# Altium project TemperatureController.PrjPcb (part 3 of 4)

## Sheet vioutchn1.SchDoc: VIOUTCHN1
size A4 portrait; Organization: 合肥弗雷电子; Address1: 玉兰大道14号D栋3楼; Address2: 肥西县桃花镇; Address3: 合肥市; Address4: 安徽省
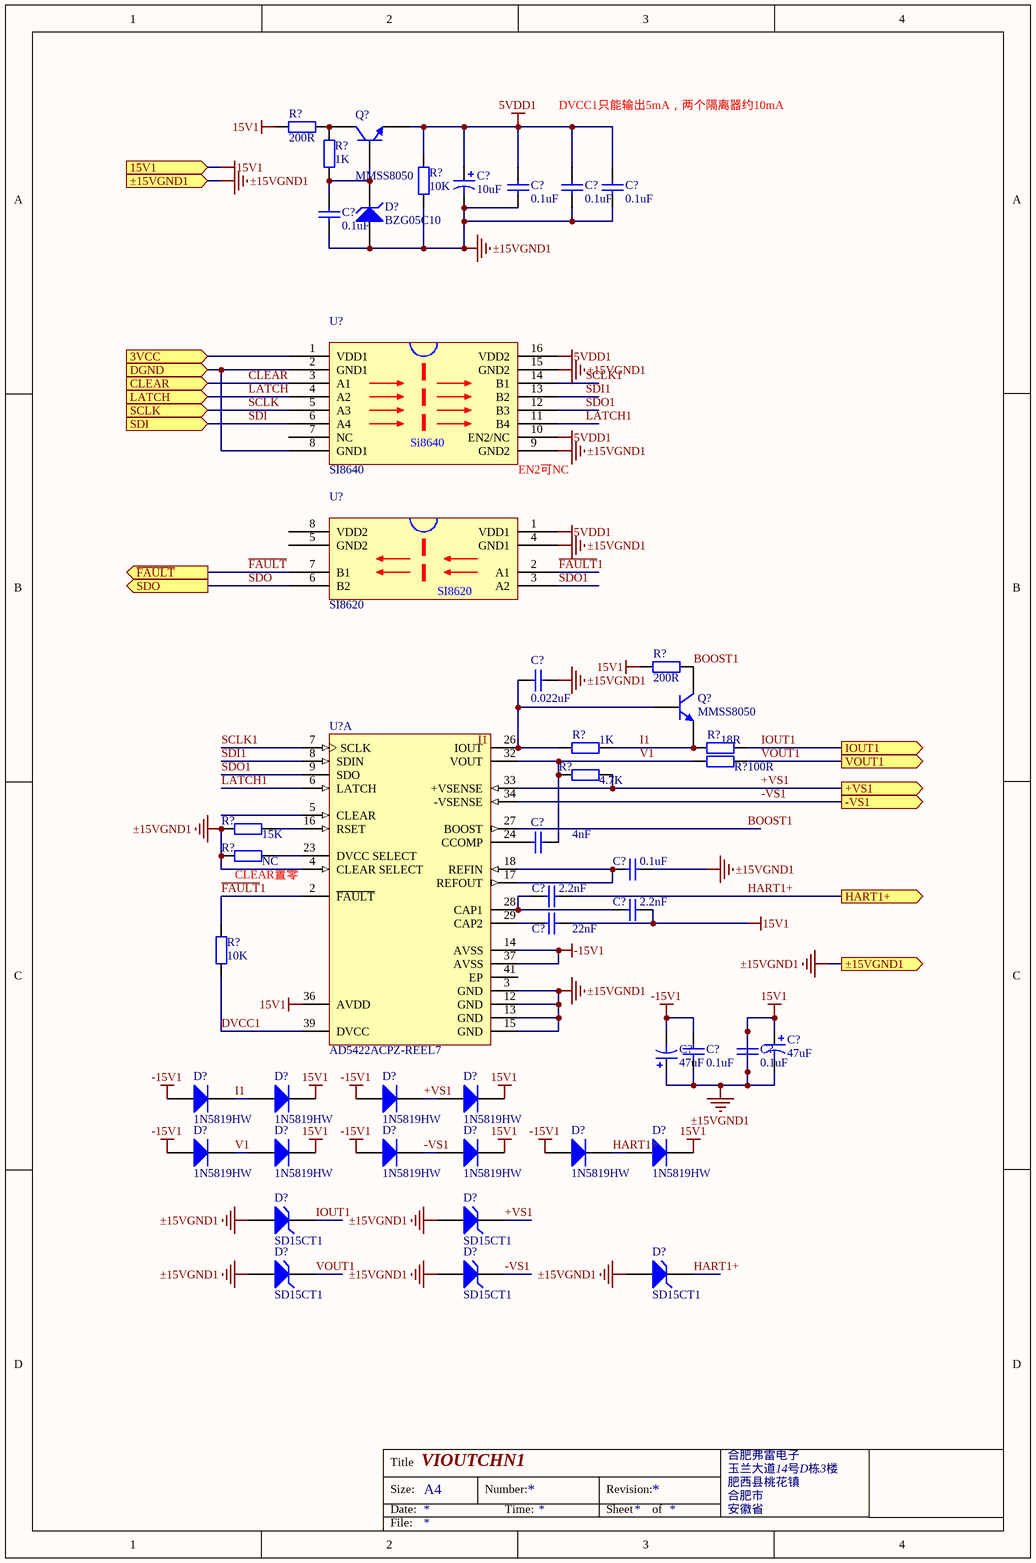
[diagram p7: vioutchn1.SchDoc]

### Parts
(Parts that share a designator on the sheet are numbered #1, #2 ... from top to bottom, then left to right.)
C?#41  value 10uF  [CB]  (hidden comment: T494B106M006AHAUTO)
C?#42  value 0.1uF  [0805c]  (hidden comment: CC0805MRX7R9BB104)
C?#43  value 0.1uF  [0805c]  (hidden comment: CC0805MRX7R9BB104)
C?#44  value 0.1uF  [0805c]  (hidden comment: CC0805MRX7R9BB104)
C?#45  value 0.1uF  [0805c]  (hidden comment: CC0805MRX7R9BB104)
C?#46  value 0.022uF  [0805c]  (hidden comment: CC0805MRX7R9BB103)
C?#47  value 4nF  [0805c]
C?#48  value 0.1uF  [0805c]  (hidden comment: CC0805MRX7R9BB104)
C?#49  value 2.2nF  [0805c]
C?#50  value 2.2nF  [0805c]
C?#51  value 22nF  [0805c]
C?#52  value 0.1uF  [0805c]  (hidden comment: CC0805MRX7R9BB104)
C?#53  value 0.1uF  [0805c]  (hidden comment: CC0805MRX7R9BB104)
C?#54  value 47uF  [CB]  (hidden comment: T494B476K025ATAUTO)
C?#55  value 47uF  [CB]  (hidden comment: T494B476K025ATAUTO)
D?#17  BZG05C10  [DO214]
D?#18  1N5819HW  [sod123]
D?#19  1N5819HW  [sod123]
D?#20  1N5819HW  [sod123]
D?#21  1N5819HW  [sod123]
D?#22  1N5819HW  [sod123]
D?#23  1N5819HW  [sod123]
D?#24  1N5819HW  [sod123]
D?#25  1N5819HW  [sod123]
D?#26  1N5819HW  [sod123]
D?#27  1N5819HW  [sod123]
D?#28  SD15CT1  [sod323]
D?#29  SD15CT1  [sod323]
D?#30  SD15CT1  [sod323]
D?#31  SD15CT1  [sod323]
D?#32  SD15CT1  [sod323]
Q?#3  MMSS8050  [SOT-23-BJT]
Q?#4  MMSS8050  [SOT-23-BJT]
R?#11  value 200R  [0805R]
R?#12  value 1K  [0805R]  (hidden comment: RC0805JR-071KL)
R?#13  value 10K  [0805R]  (hidden comment: RC0805JR-0710KL)
R?#14  value 200R  [0805R]
R?#15  value 1K  [0805R]  (hidden comment: RC0805JR-071KL)
R?#16  value 18R  [0805R]
R?#17  value 100R  [0805R]
R?#18  value 4.7K  [0805R]
R?#19  value 15K  [0805R]  (hidden comment: E192)
R?#20  value NC  [0805R]  (hidden comment: E192)
R?#21  value 10K  [0805R]  (hidden comment: RC0805JR-0710KL)
U?#15  SI8640
U?#16  SI8620
U?#17  AD5422ACPZ-REEL7  [CP-40-1_N]  (part A of 2)

### Ports
3VCC (in), 15V1 (in), +VS1 (out), -VS1 (out), CLEAR (in), DGND (in), HART1+ (out), IOUT1 (out), LATCH (in), SCLK (in), SDI (in), SDO (out), VOUT1 (out), ~{FAULT} (out), ±15VGND1 (in), ±15VGND1 (out)

### Nets
5VDD1: C?#41.1 C?#42.2 C?#43.2 C?#44.2 Q?#3.3(E) R?#13.1 U?#15.10(EN2/NC) U?#15.16(VDD2) U?#16.1(VDD1)
15V1: C?#41.2 C?#42.1 C?#43.1 C?#44.1 C?#45.2 C?#46.1 C?#48.2 C?#50.1 C?#51.1 C?#52.2 C?#53.1 C?#53.2 C?#54.1 C?#54.2 C?#55.1 D?#17.1(A) D?#19.2(K) D?#21.2(K) D?#23.2(K) D?#25.2(K) D?#27.2(K) D?#28.1(A) D?#29.1(A) D?#30.1(A) D?#31.1(A) D?#32.1(A) R?#11.2 R?#13.2 R?#14.2 R?#19.1 R?#20.1 U?#15.9(GND2) U?#15.15(GND2) U?#16.4(GND1) U?#17.3(GND) U?#17.4(CLEAR_SELECT) U?#17.12(GND) U?#17.13(GND) U?#17.15(GND) U?#17.36(AVDD) ; port 15V1, port ±15VGND1  [also labelled ±15VGND1]
-15V1: C?#52.1 C?#55.2 D?#18.1(A) D?#20.1(A) D?#22.1(A) D?#24.1(A) D?#26.1(A) U?#17.14(AVSS) U?#17.37(AVSS)
+VS1: D?#20.2(K) D?#21.1(A) D?#29.2(K) R?#18.2 U?#17.33(+VSENSE) ; port +VS1
-VS1: D?#24.2(K) D?#25.1(A) D?#31.2(K) U?#17.34(-VSENSE) ; port -VS1
BOOST1: Q?#4.1(C) R?#14.1 U?#17.27(BOOST)
CLEAR: U?#15.3(A1) ; port CLEAR
DVCC1: R?#21.2 U?#17.39(DVCC)
~{FAULT}: U?#16.7(B1) ; port ~{FAULT}
~{FAULT}1: R?#21.1 U?#16.2(A1) U?#17.2(~{FAULT})
HART1+: C?#49.1 D?#26.2(K) D?#27.1(A) D?#32.2(K) ; port HART1+
I1: D?#18.2(K) D?#19.1(A) Q?#4.3(E) R?#15.2 R?#16.1
IOUT1: D?#28.2(K) R?#16.2 ; port IOUT1
LATCH: U?#15.4(A2) ; port LATCH
LATCH1: U?#15.11(B4) U?#17.6(LATCH)
SCLK: U?#15.5(A3) ; port SCLK
SCLK1: U?#15.14(B1) U?#17.7(SCLK)
SDI: U?#15.6(A4) ; port SDI
SDI1: U?#15.13(B2) U?#17.8(SDIN)
SDO: U?#16.6(B2) ; port SDO
SDO1: U?#15.12(B3) U?#16.3(A2) U?#17.9(SDO)
V1: C?#47.2 D?#22.2(K) D?#23.1(A) R?#17.1 R?#18.1 U?#17.32(VOUT)
VOUT1: D?#30.2(K) R?#17.2 ; port VOUT1
NetC?#45_1: C?#45.1 D?#17.2(K) Q?#3.2(B) R?#12.1
NetC?#46_2: C?#46.2 Q?#4.2(B) R?#15.1 U?#17.26(IOUT)
NetC?#47_1: C?#47.1 U?#17.24(CCOMP)
NetC?#48_1: C?#48.1 U?#17.17(REFOUT) U?#17.18(REFIN)
NetC?#49_2: C?#49.2 C?#50.2 U?#17.28(CAP1)
NetC?#51_2: C?#51.2 U?#17.29(CAP2)
NetQ?#3_1: Q?#3.1(C) R?#11.1 R?#12.2
NetR?#19_2: R?#19.2 U?#17.16(RSET)
NetR?#20_2: R?#20.2 U?#17.23(DVCC_SELECT)
NetU?#15_1: U?#15.1(VDD1) ; port 3VCC
NetU?#15_2: U?#15.2(GND1) U?#15.8(GND1) ; port DGND

Not connected (* = marked no-connect by the designer): U?#15 7(NC); U?#16 5(GND2) 8(VDD2); U?#17 5(CLEAR) 41(EP)

### Notes on the sheet
- DVCC1只能输出5mA，两个隔离器约10mA
- (near U?#15) EN2可NC
- (near R?#20) CLEAR置零
- Labels drawn without touching a wire or pin: I1
- Title
- Size:
- Date:
- A4
- Number:
- Time:
- Revision:
- Sheet
- of
- File:
- (in symbol SI8640) Si8640

### Library data of the parts
C?#41 C?#54 C?#55 = Cap Pol1: Polarized Capacitor (Radial); Published: 8-Jun-2000; LatestRevisionDate: 17-Jul-2002; LatestRevisionNote: Re-released for DXP Platform.; PackageReference: RB7.6-15; Publisher: Altium Limited; PackageDescription: Polarized Capacitor (Radial); 2 Leads
C?#42-C?#53 = Cap: Capacitor; Published: 8-Jun-2000; LatestRevisionDate: 17-Jul-2002; LatestRevisionNote: Re-released for DXP Platform.; PackageReference: RAD-0.3; Publisher: Altium Limited; PackageDescription: Radial Cap, Thru-Hole; 2 Leads; 0.3 in Pin Spacing
D?#17 = BZG05C10: Silicon Zener Diode (3W); Published: 8-Jun-2000; LatestRevisionDate: 17-Jul-2002; LatestRevisionNote: Re-released for DXP Platform.; DatasheetDocument: 1-Apr-1999; PackageDocument: Apr-1999; PackageReference: DO214; Publisher: Altium Limited; ComponentLink1Description: Manufacturer Link; ComponentLink1URL: http://www.vishay.com/; ComponentLink2Description: Datasheet; ComponentLink2URL: http://www.vishay.com/docs/85595/85595.pdf
D?#18-D?#27 = Diode: Default Diode; Published: 8-Jun-2000; LatestRevisionDate: 17-Jul-2002; LatestRevisionNote: Re-released for DXP Platform.; PackageVersion: Sep-1996; PackageReference: SMC; Publisher: Altium Limited; PackageDescription: DO-214-AB/SMC; 2 C-Bend Leads; Body 7.9 x 5.9 mm, inc. leads (LxW); Code_JEDEC: DO-214-AB
D?#28-D?#32 = D Zener: Zener Diode; Published: 8-Jun-2000; LatestRevisionDate: 17-Jul-2002; LatestRevisionNote: Re-released for DXP Platform.; PackageReference: DIODE-0.7; Publisher: Altium Limited; PackageDescription: Diode, Thru-Hole; 2 Leads; 0.7 in Pin Spacing
Q?#3 Q?#4 = NPN: NPN Bipolar Transistor; Published: 8-Jun-2000; LatestRevisionDate: 17-Jul-2002; LatestRevisionNote: Re-released for DXP Platform.; PackageReference: TO-226-AA; Publisher: Altium Limited; PackageDescription: TO, Flat Index; 3 In-Line, Axial Leads; Body Dia. 4.8mm; Leads 0.55 x 0.51 mm (max); Code_JEDEC: TO-226-AA
R?#11-R?#21 = Res2: Resistor; Published: 8-Jun-2000; LatestRevisionDate: 17-Jul-2002; LatestRevisionNote: Re-released for DXP Platform.; PackageReference: AXIAL-0.4; Publisher: Altium Limited; PackageDescription: Axial Device, Thru-Hole; 2 Leads; 0.4 in Pin Spacing
U?#17 = AD5422ACPZ-REEL7: Single 16-Bit Current Source Digital-to-Analog Converter with Serial Interface and HART Connectivity, -40 to +85 degC, CP-40-1, Pb-Free, Reel; Generic Part Number: AD5422; Manufacturer: Analog Devices; # DAC Outputs: 1; Max V+: 40V; Op Pwr Diss: 158mW; Resolution (Bits): 16; Settling Time: 18祍; Single Supply: No; DatasheetVersion: Rev.E; PackageVersion: Oct-2006; PackageReference: CP-40-1; PackageDescription: 40-Pin Lead Frame Chip Scale Package [LFCSP_VQ] Very Thin Quad; Supplier 1: Digi-Key; Supplier Part Number 1: AD5422ACPZ-REEL7TR-ND; Supplier 2: Digi-Key; Supplier Part Number 2: AD5422ACPZ-REEL7CT-ND; Supplier 3: Digi-Key; Supplier Part Number 3: AD5422ACPZ-REEL7DKR-ND; Supplier 4: Mouser; Supplier Part Number 4: 584-AD5422ACPZ-R7; Packing: Reel; RoHS: Y; Mounting Technology: Surface Mount; Code_JEDEC: MO-220-VJJD-2; PartNumber: AD5422ACPZ-REEL7; ComponentLink1Description: Manufacturer URL; ComponentLink1URL: http://www.analog.com/en/index.html; ComponentLink2Description: Datasheet; ComponentLink2URL: http://www.analog.com/static/imported-files/data_sheets/AD5412_5422.pdf; ComponentLink3Description: Package Specification; ComponentLink3URL: http://www.analog.com/static/imported-files/packages/PKG_PDF/LFCSP(CP)/CP_40_1.pdf; ComponentLink4Description: Product URL; ComponentLink4URL: http://www.analog.com/en/digital-to-analog-converters/da-converters/ad5422/products/product.html; ComponentLink5Description: Reference Design URL; ComponentLink5URL: http://www.analog.com/en/digital-to-analog-converters/da-converters/ad5422/products/product.html#prod_cross_sell

## Sheet vioutchn2.SchDoc: VIOUTCHN2
size A4 portrait; Organization: 合肥弗雷电子; Address1: 玉兰大道14号D栋3楼; Address2: 肥西县桃花镇; Address3: 合肥市; Address4: 安徽省
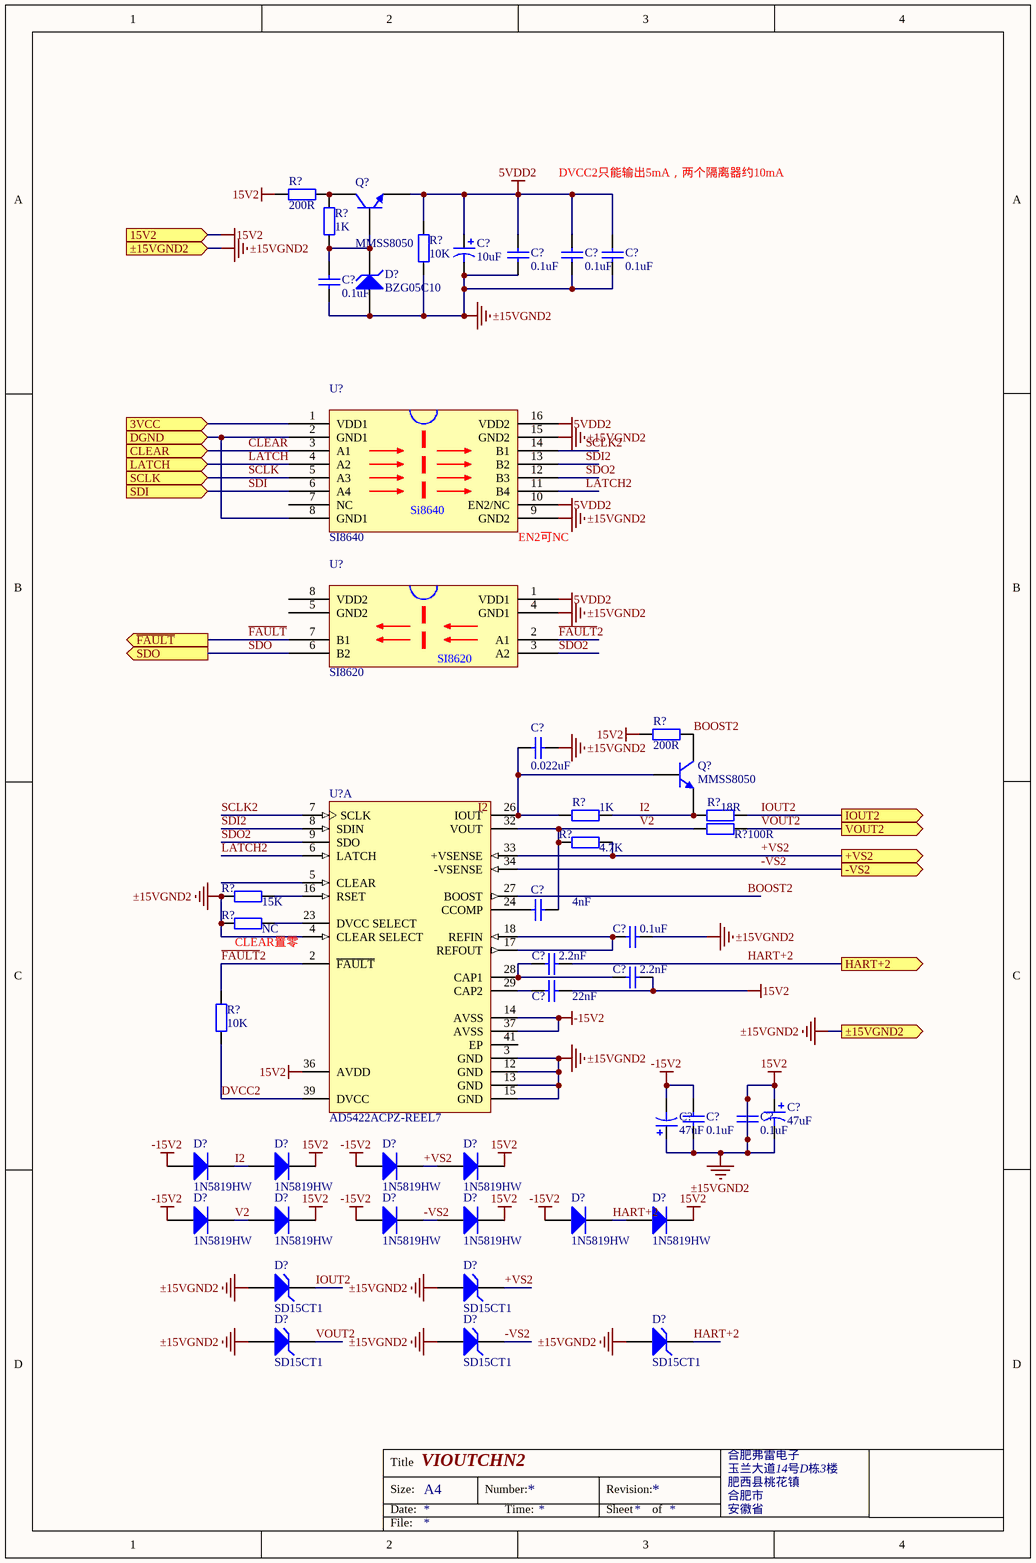
[diagram p8: vioutchn2.SchDoc]

### Parts
(Parts that share a designator on the sheet are numbered #1, #2 ... from top to bottom, then left to right.)
C?#56  value 10uF  [CB]  (hidden comment: T494B106M006AHAUTO)
C?#57  value 0.1uF  [0805c]  (hidden comment: CC0805MRX7R9BB104)
C?#58  value 0.1uF  [0805c]  (hidden comment: CC0805MRX7R9BB104)
C?#59  value 0.1uF  [0805c]  (hidden comment: CC0805MRX7R9BB104)
C?#60  value 0.1uF  [0805c]  (hidden comment: CC0805MRX7R9BB104)
C?#61  value 0.022uF  [0805c]  (hidden comment: CC0805MRX7R9BB103)
C?#62  value 4nF  [0805c]
C?#63  value 0.1uF  [0805c]  (hidden comment: CC0805MRX7R9BB104)
C?#64  value 2.2nF  [0805c]
C?#65  value 2.2nF  [0805c]
C?#66  value 22nF  [0805c]
C?#67  value 0.1uF  [0805c]  (hidden comment: CC0805MRX7R9BB104)
C?#68  value 0.1uF  [0805c]  (hidden comment: CC0805MRX7R9BB104)
C?#69  value 47uF  [CB]  (hidden comment: T494B476K025ATAUTO)
C?#70  value 47uF  [CB]  (hidden comment: T494B476K025ATAUTO)
D?#33  BZG05C10  [DO214]
D?#34  1N5819HW  [sod123]
D?#35  1N5819HW  [sod123]
D?#36  1N5819HW  [sod123]
D?#37  1N5819HW  [sod123]
D?#38  1N5819HW  [sod123]
D?#39  1N5819HW  [sod123]
D?#40  1N5819HW  [sod123]
D?#41  1N5819HW  [sod123]
D?#42  1N5819HW  [sod123]
D?#43  1N5819HW  [sod123]
D?#44  SD15CT1  [sod323]
D?#45  SD15CT1  [sod323]
D?#46  SD15CT1  [sod323]
D?#47  SD15CT1  [sod323]
D?#48  SD15CT1  [sod323]
Q?#5  MMSS8050  [SOT-23-BJT]
Q?#6  MMSS8050  [SOT-23-BJT]
R?#22  value 200R  [0805R]
R?#23  value 1K  [0805R]  (hidden comment: RC0805JR-071KL)
R?#24  value 10K  [0805R]  (hidden comment: RC0805JR-0710KL)
R?#25  value 200R  [0805R]
R?#26  value 1K  [0805R]  (hidden comment: RC0805JR-071KL)
R?#27  value 18R  [0805R]
R?#28  value 100R  [0805R]
R?#29  value 4.7K  [0805R]
R?#30  value 15K  [0805R]  (hidden comment: E192)
R?#31  value NC  [0805R]  (hidden comment: E192)
R?#32  value 10K  [0805R]  (hidden comment: RC0805JR-0710KL)
U?#18  SI8640
U?#19  SI8620
U?#20  AD5422ACPZ-REEL7  [CP-40-1_N]  (part A of 2)

### Ports
3VCC (in), 15V2 (in), +VS2 (out), -VS2 (out), CLEAR (in), DGND (in), HART+2 (out), IOUT2 (out), LATCH (in), SCLK (in), SDI (in), SDO (out), VOUT2 (out), ~{FAULT} (out), ±15VGND2 (in), ±15VGND2 (out)

### Nets
5VDD2: C?#56.1 C?#57.2 C?#58.2 C?#59.2 Q?#5.3(E) R?#24.1 U?#18.10(EN2/NC) U?#18.16(VDD2) U?#19.1(VDD1)
15V2: C?#56.2 C?#57.1 C?#58.1 C?#59.1 C?#60.2 C?#61.1 C?#63.2 C?#65.1 C?#66.1 C?#67.2 C?#68.1 C?#68.2 C?#69.1 C?#69.2 C?#70.1 D?#33.1(A) D?#35.2(K) D?#37.2(K) D?#39.2(K) D?#41.2(K) D?#43.2(K) D?#44.1(A) D?#45.1(A) D?#46.1(A) D?#47.1(A) D?#48.1(A) R?#22.2 R?#24.2 R?#25.2 R?#30.1 R?#31.1 U?#18.9(GND2) U?#18.15(GND2) U?#19.4(GND1) U?#20.3(GND) U?#20.4(CLEAR_SELECT) U?#20.12(GND) U?#20.13(GND) U?#20.15(GND) U?#20.36(AVDD) ; port 15V2, port ±15VGND2  [also labelled ±15VGND2]
-15V2: C?#67.1 C?#70.2 D?#34.1(A) D?#36.1(A) D?#38.1(A) D?#40.1(A) D?#42.1(A) U?#20.14(AVSS) U?#20.37(AVSS)
+VS2: D?#36.2(K) D?#37.1(A) D?#45.2(K) R?#29.2 U?#20.33(+VSENSE) ; port +VS2
-VS2: D?#40.2(K) D?#41.1(A) D?#47.2(K) U?#20.34(-VSENSE) ; port -VS2
BOOST2: Q?#6.1(C) R?#25.1 U?#20.27(BOOST)
CLEAR: U?#18.3(A1) ; port CLEAR
DVCC2: R?#32.2 U?#20.39(DVCC)
~{FAULT}: U?#19.7(B1) ; port ~{FAULT}
~{FAULT}2: R?#32.1 U?#19.2(A1) U?#20.2(~{FAULT})
HART+2: C?#64.1 D?#42.2(K) D?#43.1(A) D?#48.2(K) ; port HART+2
I2: D?#34.2(K) D?#35.1(A) Q?#6.3(E) R?#26.2 R?#27.1
IOUT2: D?#44.2(K) R?#27.2 ; port IOUT2
LATCH: U?#18.4(A2) ; port LATCH
LATCH2: U?#18.11(B4) U?#20.6(LATCH)
SCLK: U?#18.5(A3) ; port SCLK
SCLK2: U?#18.14(B1) U?#20.7(SCLK)
SDI: U?#18.6(A4) ; port SDI
SDI2: U?#18.13(B2) U?#20.8(SDIN)
SDO: U?#19.6(B2) ; port SDO
SDO2: U?#18.12(B3) U?#19.3(A2) U?#20.9(SDO)
V2: C?#62.2 D?#38.2(K) D?#39.1(A) R?#28.1 R?#29.1 U?#20.32(VOUT)
VOUT2: D?#46.2(K) R?#28.2 ; port VOUT2
NetC?#60_1: C?#60.1 D?#33.2(K) Q?#5.2(B) R?#23.1
NetC?#61_2: C?#61.2 Q?#6.2(B) R?#26.1 U?#20.26(IOUT)
NetC?#62_1: C?#62.1 U?#20.24(CCOMP)
NetC?#63_1: C?#63.1 U?#20.17(REFOUT) U?#20.18(REFIN)
NetC?#64_2: C?#64.2 C?#65.2 U?#20.28(CAP1)
NetC?#66_2: C?#66.2 U?#20.29(CAP2)
NetQ?#5_1: Q?#5.1(C) R?#22.1 R?#23.2
NetR?#30_2: R?#30.2 U?#20.16(RSET)
NetR?#31_2: R?#31.2 U?#20.23(DVCC_SELECT)
NetU?#18_1: U?#18.1(VDD1) ; port 3VCC
NetU?#18_2: U?#18.2(GND1) U?#18.8(GND1) ; port DGND

Not connected (* = marked no-connect by the designer): U?#18 7(NC); U?#19 5(GND2) 8(VDD2); U?#20 5(CLEAR) 41(EP)

### Notes on the sheet
- DVCC2只能输出5mA，两个隔离器约10mA
- (near U?#18) EN2可NC
- (near R?#31) CLEAR置零
- Labels drawn without touching a wire or pin: I2
- Title
- Size:
- Date:
- A4
- Number:
- Time:
- Revision:
- Sheet
- of
- File:
- (in symbol SI8640) Si8640

### Library data of the parts
C?#56 C?#69 C?#70 = Cap Pol1: Polarized Capacitor (Radial); Published: 8-Jun-2000; LatestRevisionDate: 17-Jul-2002; LatestRevisionNote: Re-released for DXP Platform.; PackageReference: RB7.6-15; Publisher: Altium Limited; PackageDescription: Polarized Capacitor (Radial); 2 Leads
C?#57-C?#68 = Cap: Capacitor; Published: 8-Jun-2000; LatestRevisionDate: 17-Jul-2002; LatestRevisionNote: Re-released for DXP Platform.; PackageReference: RAD-0.3; Publisher: Altium Limited; PackageDescription: Radial Cap, Thru-Hole; 2 Leads; 0.3 in Pin Spacing
D?#33 = BZG05C10: Silicon Zener Diode (3W); Published: 8-Jun-2000; LatestRevisionDate: 17-Jul-2002; LatestRevisionNote: Re-released for DXP Platform.; DatasheetDocument: 1-Apr-1999; PackageDocument: Apr-1999; PackageReference: DO214; Publisher: Altium Limited; ComponentLink1Description: Manufacturer Link; ComponentLink1URL: http://www.vishay.com/; ComponentLink2Description: Datasheet; ComponentLink2URL: http://www.vishay.com/docs/85595/85595.pdf
D?#34-D?#43 = Diode: Default Diode; Published: 8-Jun-2000; LatestRevisionDate: 17-Jul-2002; LatestRevisionNote: Re-released for DXP Platform.; PackageVersion: Sep-1996; PackageReference: SMC; Publisher: Altium Limited; PackageDescription: DO-214-AB/SMC; 2 C-Bend Leads; Body 7.9 x 5.9 mm, inc. leads (LxW); Code_JEDEC: DO-214-AB
D?#44-D?#48 = D Zener: Zener Diode; Published: 8-Jun-2000; LatestRevisionDate: 17-Jul-2002; LatestRevisionNote: Re-released for DXP Platform.; PackageReference: DIODE-0.7; Publisher: Altium Limited; PackageDescription: Diode, Thru-Hole; 2 Leads; 0.7 in Pin Spacing
Q?#5 Q?#6 = NPN: NPN Bipolar Transistor; Published: 8-Jun-2000; LatestRevisionDate: 17-Jul-2002; LatestRevisionNote: Re-released for DXP Platform.; PackageReference: TO-226-AA; Publisher: Altium Limited; PackageDescription: TO, Flat Index; 3 In-Line, Axial Leads; Body Dia. 4.8mm; Leads 0.55 x 0.51 mm (max); Code_JEDEC: TO-226-AA
R?#22-R?#32 = Res2: Resistor; Published: 8-Jun-2000; LatestRevisionDate: 17-Jul-2002; LatestRevisionNote: Re-released for DXP Platform.; PackageReference: AXIAL-0.4; Publisher: Altium Limited; PackageDescription: Axial Device, Thru-Hole; 2 Leads; 0.4 in Pin Spacing
U?#20 = AD5422ACPZ-REEL7: as U?#17 on sheet vioutchn1; DatasheetVersion: Rev.E; PackageVersion: Oct-2006; PackageReference: CP-40-1; PackageDescription: 40-Pin Lead Frame Chip Scale Package [LFCSP_VQ] Very Thin Quad; Supplier 1: Digi-Key; Supplier Part Number 1: AD5422ACPZ-REEL7TR-ND; Supplier 2: Digi-Key; Supplier Part Number 2: AD5422ACPZ-REEL7CT-ND; Supplier 3: Digi-Key; Supplier Part Number 3: AD5422ACPZ-REEL7DKR-ND; Supplier 4: Mouser; Supplier Part Number 4: 584-AD5422ACPZ-R7; Packing: Reel; RoHS: Y; Mounting Technology: Surface Mount; Code_JEDEC: MO-220-VJJD-2; PartNumber: AD5422ACPZ-REEL7; ComponentLink1Description: Manufacturer URL; ComponentLink1URL: http://www.analog.com/en/index.html; ComponentLink2Description: Datasheet; ComponentLink2URL: http://www.analog.com/static/imported-files/data_sheets/AD5412_5422.pdf; ComponentLink3Description: Package Specification; ComponentLink3URL: http://www.analog.com/static/imported-files/packages/PKG_PDF/LFCSP(CP)/CP_40_1.pdf; ComponentLink4Description: Product URL; ComponentLink4URL: http://www.analog.com/en/digital-to-analog-converters/da-converters/ad5422/products/product.html; ComponentLink5Description: Reference Design URL; ComponentLink5URL: http://www.analog.com/en/digital-to-analog-converters/da-converters/ad5422/products/product.html#prod_cross_sell

## Sheet vioutchn3.SchDoc: VIOUTCHN3
size A4 portrait; Organization: 合肥弗雷电子; Address1: 玉兰大道14号D栋3楼; Address2: 肥西县桃花镇; Address3: 合肥市; Address4: 安徽省
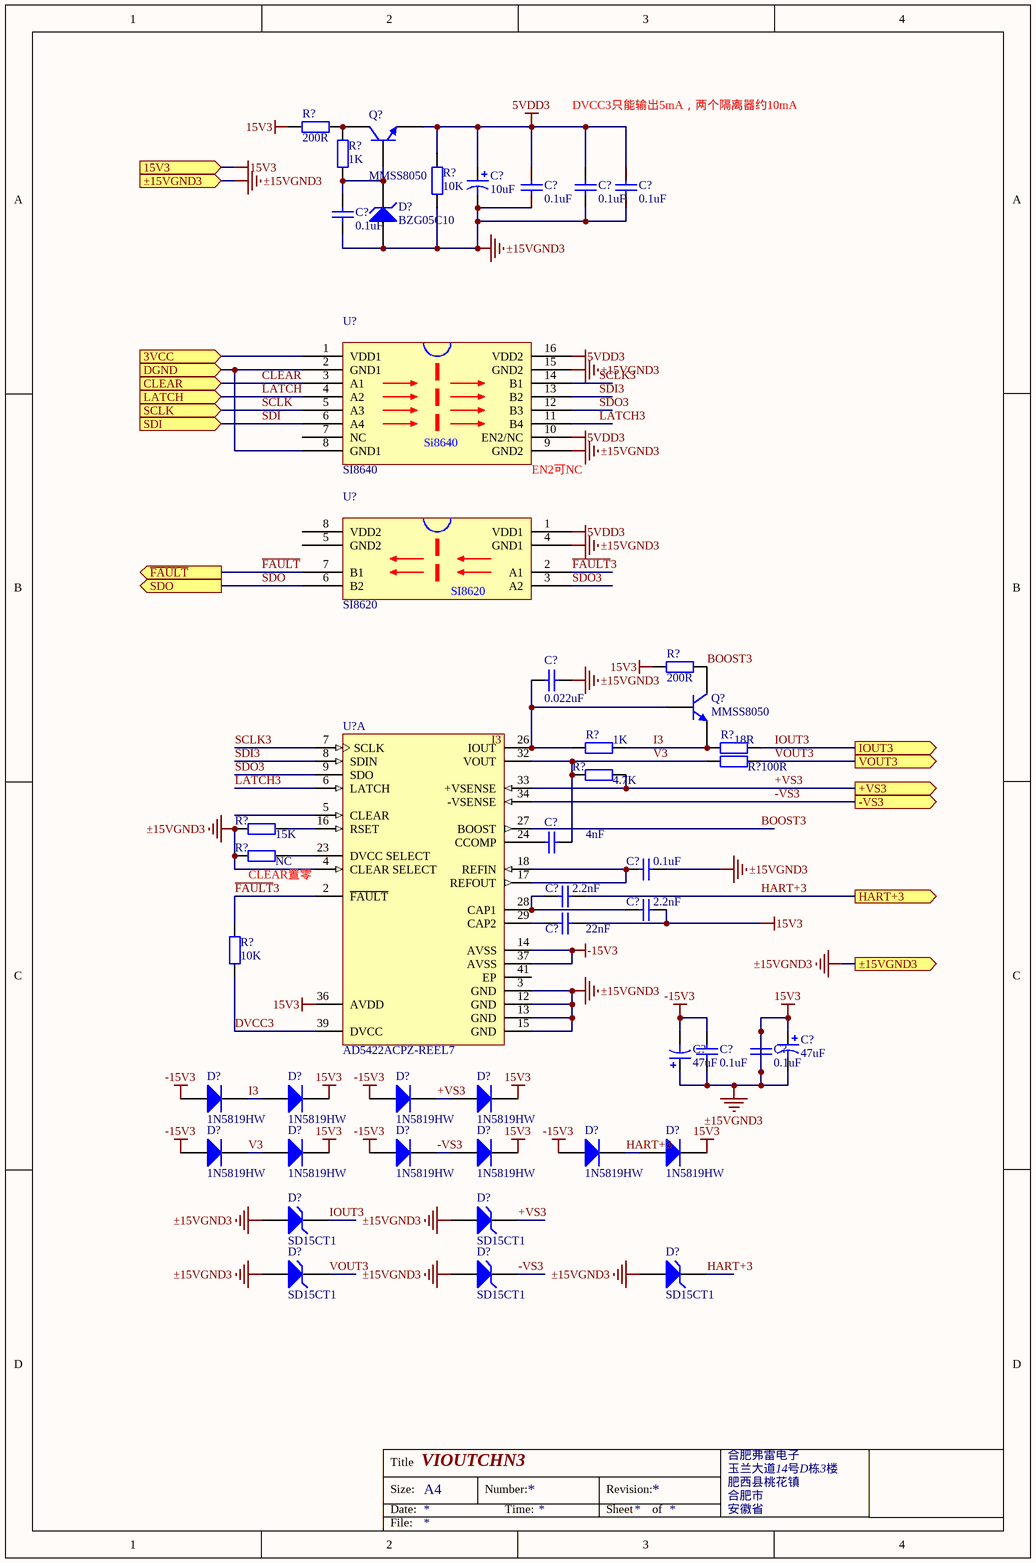
[diagram p9: vioutchn3.SchDoc]

### Parts
(Parts that share a designator on the sheet are numbered #1, #2 ... from top to bottom, then left to right.)
C?#71  value 10uF  [CB]  (hidden comment: T494B106M006AHAUTO)
C?#72  value 0.1uF  [0805c]  (hidden comment: CC0805MRX7R9BB104)
C?#73  value 0.1uF  [0805c]  (hidden comment: CC0805MRX7R9BB104)
C?#74  value 0.1uF  [0805c]  (hidden comment: CC0805MRX7R9BB104)
C?#75  value 0.1uF  [0805c]  (hidden comment: CC0805MRX7R9BB104)
C?#76  value 0.022uF  [0805c]  (hidden comment: CC0805MRX7R9BB103)
C?#77  value 4nF  [0805c]
C?#78  value 0.1uF  [0805c]  (hidden comment: CC0805MRX7R9BB104)
C?#79  value 2.2nF  [0805c]
C?#80  value 2.2nF  [0805c]
C?#81  value 22nF  [0805c]
C?#82  value 0.1uF  [0805c]  (hidden comment: CC0805MRX7R9BB104)
C?#83  value 0.1uF  [0805c]  (hidden comment: CC0805MRX7R9BB104)
C?#84  value 47uF  [CB]  (hidden comment: T494B476K025ATAUTO)
C?#85  value 47uF  [CB]  (hidden comment: T494B476K025ATAUTO)
D?#49  BZG05C10  [DO214]
D?#50  1N5819HW  [sod123]
D?#51  1N5819HW  [sod123]
D?#52  1N5819HW  [sod123]
D?#53  1N5819HW  [sod123]
D?#54  1N5819HW  [sod123]
D?#55  1N5819HW  [sod123]
D?#56  1N5819HW  [sod123]
D?#57  1N5819HW  [sod123]
D?#58  1N5819HW  [sod123]
D?#59  1N5819HW  [sod123]
D?#60  SD15CT1  [sod323]
D?#61  SD15CT1  [sod323]
D?#62  SD15CT1  [sod323]
D?#63  SD15CT1  [sod323]
D?#64  SD15CT1  [sod323]
Q?#7  MMSS8050  [SOT-23-BJT]
Q?#8  MMSS8050  [SOT-23-BJT]
R?#33  value 200R  [0805R]
R?#34  value 1K  [0805R]  (hidden comment: RC0805JR-071KL)
R?#35  value 10K  [0805R]  (hidden comment: RC0805JR-0710KL)
R?#36  value 200R  [0805R]
R?#37  value 1K  [0805R]  (hidden comment: RC0805JR-071KL)
R?#38  value 18R  [0805R]
R?#39  value 100R  [0805R]
R?#40  value 4.7K  [0805R]
R?#41  value 15K  [0805R]  (hidden comment: E192)
R?#42  value NC  [0805R]  (hidden comment: E192)
R?#43  value 10K  [0805R]  (hidden comment: RC0805JR-0710KL)
U?#21  SI8640
U?#22  SI8620
U?#23  AD5422ACPZ-REEL7  [CP-40-1_N]  (part A of 2)

### Ports
3VCC (in), 15V3 (in), +VS3 (out), -VS3 (out), CLEAR (in), DGND (in), HART+3 (out), IOUT3 (out), LATCH (in), SCLK (in), SDI (in), SDO (out), VOUT3 (out), ~{FAULT} (out), ±15VGND3 (in), ±15VGND3 (out)

### Nets
5VDD3: C?#71.1 C?#72.2 C?#73.2 C?#74.2 Q?#7.3(E) R?#35.1 U?#21.10(EN2/NC) U?#21.16(VDD2) U?#22.1(VDD1)
15V3: C?#71.2 C?#72.1 C?#73.1 C?#74.1 C?#75.2 C?#76.1 C?#78.2 C?#80.1 C?#81.1 C?#82.2 C?#83.1 C?#83.2 C?#84.1 C?#84.2 C?#85.1 D?#49.1(A) D?#51.2(K) D?#53.2(K) D?#55.2(K) D?#57.2(K) D?#59.2(K) D?#60.1(A) D?#61.1(A) D?#62.1(A) D?#63.1(A) D?#64.1(A) R?#33.2 R?#35.2 R?#36.2 R?#41.1 R?#42.1 U?#21.9(GND2) U?#21.15(GND2) U?#22.4(GND1) U?#23.3(GND) U?#23.4(CLEAR_SELECT) U?#23.12(GND) U?#23.13(GND) U?#23.15(GND) U?#23.36(AVDD) ; port 15V3, port ±15VGND3  [also labelled ±15VGND3]
-15V3: C?#82.1 C?#85.2 D?#50.1(A) D?#52.1(A) D?#54.1(A) D?#56.1(A) D?#58.1(A) U?#23.14(AVSS) U?#23.37(AVSS)
+VS3: D?#52.2(K) D?#53.1(A) D?#61.2(K) R?#40.2 U?#23.33(+VSENSE) ; port +VS3
-VS3: D?#56.2(K) D?#57.1(A) D?#63.2(K) U?#23.34(-VSENSE) ; port -VS3
BOOST3: Q?#8.1(C) R?#36.1 U?#23.27(BOOST)
CLEAR: U?#21.3(A1) ; port CLEAR
DVCC3: R?#43.2 U?#23.39(DVCC)
~{FAULT}: U?#22.7(B1) ; port ~{FAULT}
~{FAULT}3: R?#43.1 U?#22.2(A1) U?#23.2(~{FAULT})
HART+3: C?#79.1 D?#58.2(K) D?#59.1(A) D?#64.2(K) ; port HART+3
I3: D?#50.2(K) D?#51.1(A) Q?#8.3(E) R?#37.2 R?#38.1
IOUT3: D?#60.2(K) R?#38.2 ; port IOUT3
LATCH: U?#21.4(A2) ; port LATCH
LATCH3: U?#21.11(B4) U?#23.6(LATCH)
SCLK: U?#21.5(A3) ; port SCLK
SCLK3: U?#21.14(B1) U?#23.7(SCLK)
SDI: U?#21.6(A4) ; port SDI
SDI3: U?#21.13(B2) U?#23.8(SDIN)
SDO: U?#22.6(B2) ; port SDO
SDO3: U?#21.12(B3) U?#22.3(A2) U?#23.9(SDO)
V3: C?#77.2 D?#54.2(K) D?#55.1(A) R?#39.1 R?#40.1 U?#23.32(VOUT)
VOUT3: D?#62.2(K) R?#39.2 ; port VOUT3
NetC?#75_1: C?#75.1 D?#49.2(K) Q?#7.2(B) R?#34.1
NetC?#76_2: C?#76.2 Q?#8.2(B) R?#37.1 U?#23.26(IOUT)
NetC?#77_1: C?#77.1 U?#23.24(CCOMP)
NetC?#78_1: C?#78.1 U?#23.17(REFOUT) U?#23.18(REFIN)
NetC?#79_2: C?#79.2 C?#80.2 U?#23.28(CAP1)
NetC?#81_2: C?#81.2 U?#23.29(CAP2)
NetQ?#7_1: Q?#7.1(C) R?#33.1 R?#34.2
NetR?#41_2: R?#41.2 U?#23.16(RSET)
NetR?#42_2: R?#42.2 U?#23.23(DVCC_SELECT)
NetU?#21_1: U?#21.1(VDD1) ; port 3VCC
NetU?#21_2: U?#21.2(GND1) U?#21.8(GND1) ; port DGND

Not connected (* = marked no-connect by the designer): U?#21 7(NC); U?#22 5(GND2) 8(VDD2); U?#23 5(CLEAR) 41(EP)

### Notes on the sheet
- DVCC3只能输出5mA，两个隔离器约10mA
- (near U?#21) EN2可NC
- (near R?#42) CLEAR置零
- Labels drawn without touching a wire or pin: I3
- Title
- Size:
- Date:
- A4
- Number:
- Time:
- Revision:
- Sheet
- of
- File:
- (in symbol SI8640) Si8640

### Library data of the parts
C?#71 C?#84 C?#85 = Cap Pol1: Polarized Capacitor (Radial); Published: 8-Jun-2000; LatestRevisionDate: 17-Jul-2002; LatestRevisionNote: Re-released for DXP Platform.; PackageReference: RB7.6-15; Publisher: Altium Limited; PackageDescription: Polarized Capacitor (Radial); 2 Leads
C?#72-C?#83 = Cap: Capacitor; Published: 8-Jun-2000; LatestRevisionDate: 17-Jul-2002; LatestRevisionNote: Re-released for DXP Platform.; PackageReference: RAD-0.3; Publisher: Altium Limited; PackageDescription: Radial Cap, Thru-Hole; 2 Leads; 0.3 in Pin Spacing
D?#49 = BZG05C10: Silicon Zener Diode (3W); Published: 8-Jun-2000; LatestRevisionDate: 17-Jul-2002; LatestRevisionNote: Re-released for DXP Platform.; DatasheetDocument: 1-Apr-1999; PackageDocument: Apr-1999; PackageReference: DO214; Publisher: Altium Limited; ComponentLink1Description: Manufacturer Link; ComponentLink1URL: http://www.vishay.com/; ComponentLink2Description: Datasheet; ComponentLink2URL: http://www.vishay.com/docs/85595/85595.pdf
D?#50-D?#59 = Diode: Default Diode; Published: 8-Jun-2000; LatestRevisionDate: 17-Jul-2002; LatestRevisionNote: Re-released for DXP Platform.; PackageVersion: Sep-1996; PackageReference: SMC; Publisher: Altium Limited; PackageDescription: DO-214-AB/SMC; 2 C-Bend Leads; Body 7.9 x 5.9 mm, inc. leads (LxW); Code_JEDEC: DO-214-AB
D?#60-D?#64 = D Zener: Zener Diode; Published: 8-Jun-2000; LatestRevisionDate: 17-Jul-2002; LatestRevisionNote: Re-released for DXP Platform.; PackageReference: DIODE-0.7; Publisher: Altium Limited; PackageDescription: Diode, Thru-Hole; 2 Leads; 0.7 in Pin Spacing
Q?#7 Q?#8 = NPN: NPN Bipolar Transistor; Published: 8-Jun-2000; LatestRevisionDate: 17-Jul-2002; LatestRevisionNote: Re-released for DXP Platform.; PackageReference: TO-226-AA; Publisher: Altium Limited; PackageDescription: TO, Flat Index; 3 In-Line, Axial Leads; Body Dia. 4.8mm; Leads 0.55 x 0.51 mm (max); Code_JEDEC: TO-226-AA
R?#33-R?#43 = Res2: Resistor; Published: 8-Jun-2000; LatestRevisionDate: 17-Jul-2002; LatestRevisionNote: Re-released for DXP Platform.; PackageReference: AXIAL-0.4; Publisher: Altium Limited; PackageDescription: Axial Device, Thru-Hole; 2 Leads; 0.4 in Pin Spacing
U?#23 = AD5422ACPZ-REEL7: as U?#17 on sheet vioutchn1; DatasheetVersion: Rev.E; PackageVersion: Oct-2006; PackageReference: CP-40-1; PackageDescription: 40-Pin Lead Frame Chip Scale Package [LFCSP_VQ] Very Thin Quad; Supplier 1: Digi-Key; Supplier Part Number 1: AD5422ACPZ-REEL7TR-ND; Supplier 2: Digi-Key; Supplier Part Number 2: AD5422ACPZ-REEL7CT-ND; Supplier 3: Digi-Key; Supplier Part Number 3: AD5422ACPZ-REEL7DKR-ND; Supplier 4: Mouser; Supplier Part Number 4: 584-AD5422ACPZ-R7; Packing: Reel; RoHS: Y; Mounting Technology: Surface Mount; Code_JEDEC: MO-220-VJJD-2; PartNumber: AD5422ACPZ-REEL7; ComponentLink1Description: Manufacturer URL; ComponentLink1URL: http://www.analog.com/en/index.html; ComponentLink2Description: Datasheet; ComponentLink2URL: http://www.analog.com/static/imported-files/data_sheets/AD5412_5422.pdf; ComponentLink3Description: Package Specification; ComponentLink3URL: http://www.analog.com/static/imported-files/packages/PKG_PDF/LFCSP(CP)/CP_40_1.pdf; ComponentLink4Description: Product URL; ComponentLink4URL: http://www.analog.com/en/digital-to-analog-converters/da-converters/ad5422/products/product.html; ComponentLink5Description: Reference Design URL; ComponentLink5URL: http://www.analog.com/en/digital-to-analog-converters/da-converters/ad5422/products/product.html#prod_cross_sell

## Sheet vioutchn4.SchDoc: VIOUTCHN1
size A4 portrait; Organization: 合肥弗雷电子; Address1: 玉兰大道14号D栋3楼; Address2: 肥西县桃花镇; Address3: 合肥市; Address4: 安徽省
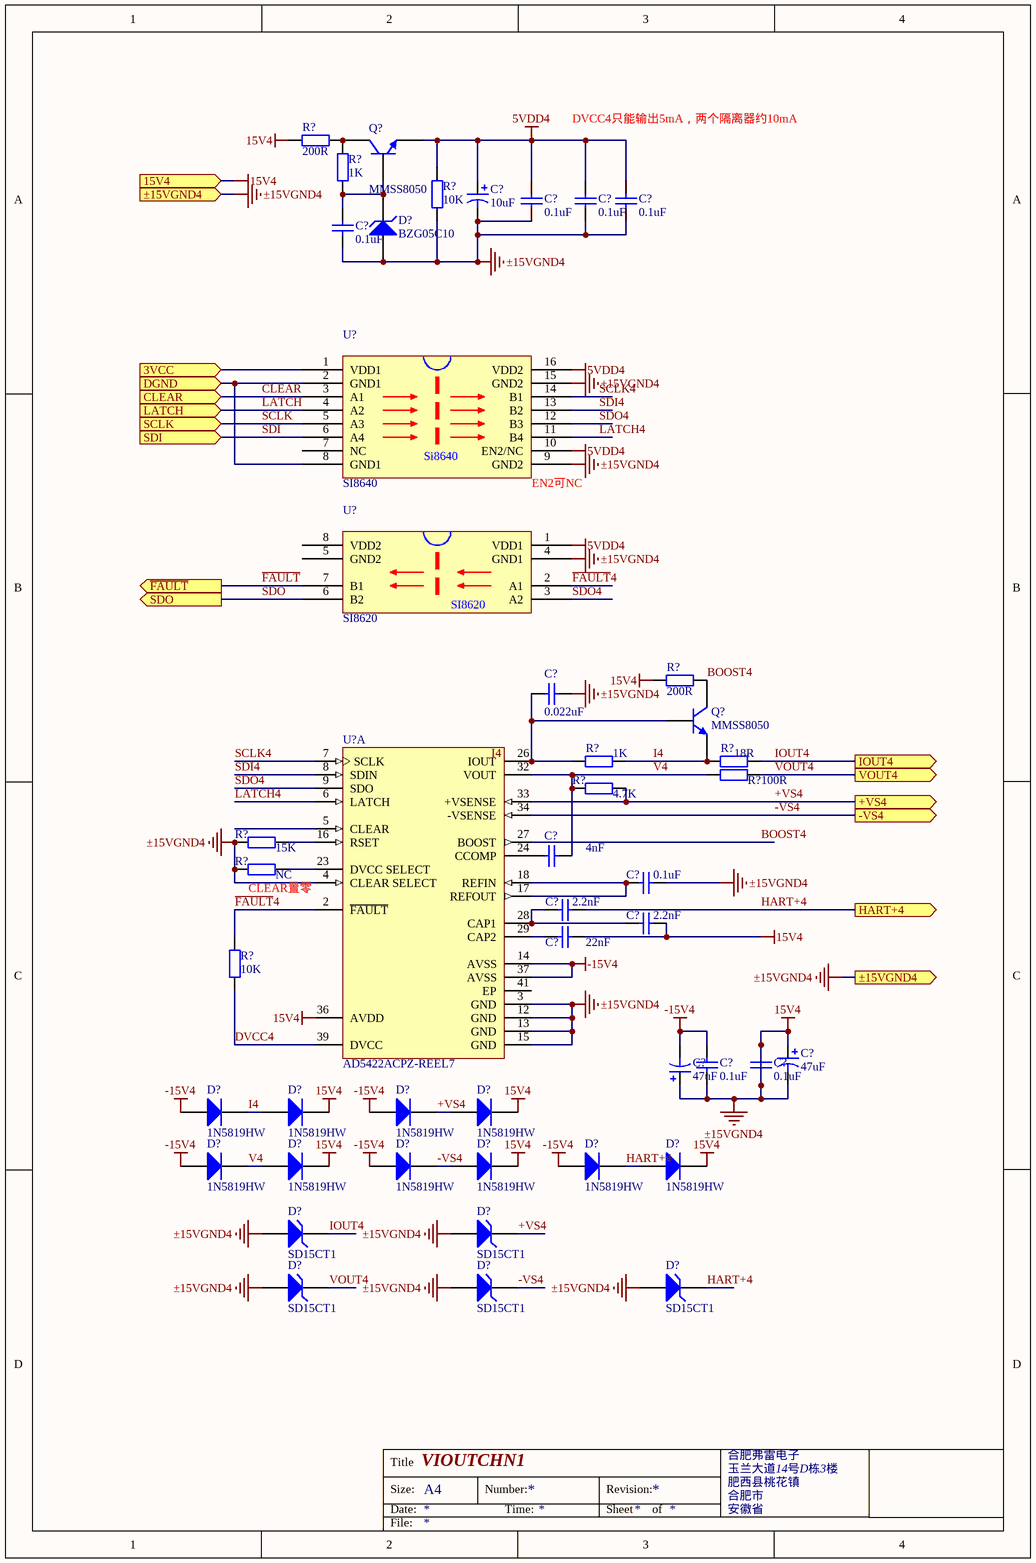
[diagram p10: vioutchn4.SchDoc]

### Parts
(Parts that share a designator on the sheet are numbered #1, #2 ... from top to bottom, then left to right.)
C?#86  value 10uF  [CB]  (hidden comment: T494B106M006AHAUTO)
C?#87  value 0.1uF  [0805c]  (hidden comment: CC0805MRX7R9BB104)
C?#88  value 0.1uF  [0805c]  (hidden comment: CC0805MRX7R9BB104)
C?#89  value 0.1uF  [0805c]  (hidden comment: CC0805MRX7R9BB104)
C?#90  value 0.1uF  [0805c]  (hidden comment: CC0805MRX7R9BB104)
C?#91  value 0.022uF  [0805c]  (hidden comment: CC0805MRX7R9BB103)
C?#92  value 4nF  [0805c]
C?#93  value 0.1uF  [0805c]  (hidden comment: CC0805MRX7R9BB104)
C?#94  value 2.2nF  [0805c]
C?#95  value 2.2nF  [0805c]
C?#96  value 22nF  [0805c]
C?#97  value 0.1uF  [0805c]  (hidden comment: CC0805MRX7R9BB104)
C?#98  value 0.1uF  [0805c]  (hidden comment: CC0805MRX7R9BB104)
C?#99  value 47uF  [CB]  (hidden comment: T494B476K025ATAUTO)
C?#100  value 47uF  [CB]  (hidden comment: T494B476K025ATAUTO)
D?#65  BZG05C10  [DO214]
D?#66  1N5819HW  [sod123]
D?#67  1N5819HW  [sod123]
D?#68  1N5819HW  [sod123]
D?#69  1N5819HW  [sod123]
D?#70  1N5819HW  [sod123]
D?#71  1N5819HW  [sod123]
D?#72  1N5819HW  [sod123]
D?#73  1N5819HW  [sod123]
D?#74  1N5819HW  [sod123]
D?#75  1N5819HW  [sod123]
D?#76  SD15CT1  [sod323]
D?#77  SD15CT1  [sod323]
D?#78  SD15CT1  [sod323]
D?#79  SD15CT1  [sod323]
D?#80  SD15CT1  [sod323]
Q?#9  MMSS8050  [SOT-23-BJT]
Q?#10  MMSS8050  [SOT-23-BJT]
R?#44  value 200R  [0805R]
R?#45  value 1K  [0805R]  (hidden comment: RC0805JR-071KL)
R?#46  value 10K  [0805R]  (hidden comment: RC0805JR-0710KL)
R?#47  value 200R  [0805R]
R?#48  value 1K  [0805R]  (hidden comment: RC0805JR-071KL)
R?#49  value 18R  [0805R]
R?#50  value 100R  [0805R]
R?#51  value 4.7K  [0805R]
R?#52  value 15K  [0805R]  (hidden comment: E192)
R?#53  value NC  [0805R]  (hidden comment: E192)
R?#54  value 10K  [0805R]  (hidden comment: RC0805JR-0710KL)
U?#24  SI8640
U?#25  SI8620
U?#26  AD5422ACPZ-REEL7  [CP-40-1_N]  (part A of 2)

### Ports
3VCC (in), 15V4 (in), +VS4 (out), -VS4 (out), CLEAR (in), DGND (in), HART+4 (out), IOUT4 (out), LATCH (in), SCLK (in), SDI (in), SDO (out), VOUT4 (out), ~{FAULT} (out), ±15VGND4 (in), ±15VGND4 (out)

### Nets
5VDD4: C?#86.1 C?#87.2 C?#88.2 C?#89.2 Q?#9.3(E) R?#46.1 U?#24.10(EN2/NC) U?#24.16(VDD2) U?#25.1(VDD1)
15V4: C?#86.2 C?#87.1 C?#88.1 C?#89.1 C?#90.2 C?#91.1 C?#93.2 C?#95.1 C?#96.1 C?#97.2 C?#98.1 C?#98.2 C?#99.1 C?#99.2 C?#100.1 D?#65.1(A) D?#67.2(K) D?#69.2(K) D?#71.2(K) D?#73.2(K) D?#75.2(K) D?#76.1(A) D?#77.1(A) D?#78.1(A) D?#79.1(A) D?#80.1(A) R?#44.2 R?#46.2 R?#47.2 R?#52.1 R?#53.1 U?#24.9(GND2) U?#24.15(GND2) U?#25.4(GND1) U?#26.3(GND) U?#26.4(CLEAR_SELECT) U?#26.12(GND) U?#26.13(GND) U?#26.15(GND) U?#26.36(AVDD) ; port 15V4, port ±15VGND4  [also labelled ±15VGND4]
-15V4: C?#97.1 C?#100.2 D?#66.1(A) D?#68.1(A) D?#70.1(A) D?#72.1(A) D?#74.1(A) U?#26.14(AVSS) U?#26.37(AVSS)
+VS4: D?#68.2(K) D?#69.1(A) D?#77.2(K) R?#51.2 U?#26.33(+VSENSE) ; port +VS4
-VS4: D?#72.2(K) D?#73.1(A) D?#79.2(K) U?#26.34(-VSENSE) ; port -VS4
BOOST4: Q?#10.1(C) R?#47.1 U?#26.27(BOOST)
CLEAR: U?#24.3(A1) ; port CLEAR
DVCC4: R?#54.2 U?#26.39(DVCC)
~{FAULT}: U?#25.7(B1) ; port ~{FAULT}
~{FAULT}4: R?#54.1 U?#25.2(A1) U?#26.2(~{FAULT})
HART+4: C?#94.1 D?#74.2(K) D?#75.1(A) D?#80.2(K) ; port HART+4
I4: D?#66.2(K) D?#67.1(A) Q?#10.3(E) R?#48.2 R?#49.1
IOUT4: D?#76.2(K) R?#49.2 ; port IOUT4
LATCH: U?#24.4(A2) ; port LATCH
LATCH4: U?#24.11(B4) U?#26.6(LATCH)
SCLK: U?#24.5(A3) ; port SCLK
SCLK4: U?#24.14(B1) U?#26.7(SCLK)
SDI: U?#24.6(A4) ; port SDI
SDI4: U?#24.13(B2) U?#26.8(SDIN)
SDO: U?#25.6(B2) ; port SDO
SDO4: U?#24.12(B3) U?#25.3(A2) U?#26.9(SDO)
V4: C?#92.2 D?#70.2(K) D?#71.1(A) R?#50.1 R?#51.1 U?#26.32(VOUT)
VOUT4: D?#78.2(K) R?#50.2 ; port VOUT4
NetC?#90_1: C?#90.1 D?#65.2(K) Q?#9.2(B) R?#45.1
NetC?#91_2: C?#91.2 Q?#10.2(B) R?#48.1 U?#26.26(IOUT)
NetC?#92_1: C?#92.1 U?#26.24(CCOMP)
NetC?#93_1: C?#93.1 U?#26.17(REFOUT) U?#26.18(REFIN)
NetC?#94_2: C?#94.2 C?#95.2 U?#26.28(CAP1)
NetC?#96_2: C?#96.2 U?#26.29(CAP2)
NetQ?#9_1: Q?#9.1(C) R?#44.1 R?#45.2
NetR?#52_2: R?#52.2 U?#26.16(RSET)
NetR?#53_2: R?#53.2 U?#26.23(DVCC_SELECT)
NetU?#24_1: U?#24.1(VDD1) ; port 3VCC
NetU?#24_2: U?#24.2(GND1) U?#24.8(GND1) ; port DGND

Not connected (* = marked no-connect by the designer): U?#24 7(NC); U?#25 5(GND2) 8(VDD2); U?#26 5(CLEAR) 41(EP)

### Notes on the sheet
- DVCC4只能输出5mA，两个隔离器约10mA
- (near U?#24) EN2可NC
- (near R?#53) CLEAR置零
- Labels drawn without touching a wire or pin: I4
- Title
- Size:
- Date:
- A4
- Number:
- Time:
- Revision:
- Sheet
- of
- File:
- (in symbol SI8640) Si8640

### Library data of the parts
C?#86 C?#99 C?#100 = Cap Pol1: Polarized Capacitor (Radial); Published: 8-Jun-2000; LatestRevisionDate: 17-Jul-2002; LatestRevisionNote: Re-released for DXP Platform.; PackageReference: RB7.6-15; Publisher: Altium Limited; PackageDescription: Polarized Capacitor (Radial); 2 Leads
C?#87-C?#98 = Cap: Capacitor; Published: 8-Jun-2000; LatestRevisionDate: 17-Jul-2002; LatestRevisionNote: Re-released for DXP Platform.; PackageReference: RAD-0.3; Publisher: Altium Limited; PackageDescription: Radial Cap, Thru-Hole; 2 Leads; 0.3 in Pin Spacing
D?#65 = BZG05C10: Silicon Zener Diode (3W); Published: 8-Jun-2000; LatestRevisionDate: 17-Jul-2002; LatestRevisionNote: Re-released for DXP Platform.; DatasheetDocument: 1-Apr-1999; PackageDocument: Apr-1999; PackageReference: DO214; Publisher: Altium Limited; ComponentLink1Description: Manufacturer Link; ComponentLink1URL: http://www.vishay.com/; ComponentLink2Description: Datasheet; ComponentLink2URL: http://www.vishay.com/docs/85595/85595.pdf
D?#66-D?#75 = Diode: Default Diode; Published: 8-Jun-2000; LatestRevisionDate: 17-Jul-2002; LatestRevisionNote: Re-released for DXP Platform.; PackageVersion: Sep-1996; PackageReference: SMC; Publisher: Altium Limited; PackageDescription: DO-214-AB/SMC; 2 C-Bend Leads; Body 7.9 x 5.9 mm, inc. leads (LxW); Code_JEDEC: DO-214-AB
D?#76-D?#80 = D Zener: Zener Diode; Published: 8-Jun-2000; LatestRevisionDate: 17-Jul-2002; LatestRevisionNote: Re-released for DXP Platform.; PackageReference: DIODE-0.7; Publisher: Altium Limited; PackageDescription: Diode, Thru-Hole; 2 Leads; 0.7 in Pin Spacing
Q?#9 Q?#10 = NPN: NPN Bipolar Transistor; Published: 8-Jun-2000; LatestRevisionDate: 17-Jul-2002; LatestRevisionNote: Re-released for DXP Platform.; PackageReference: TO-226-AA; Publisher: Altium Limited; PackageDescription: TO, Flat Index; 3 In-Line, Axial Leads; Body Dia. 4.8mm; Leads 0.55 x 0.51 mm (max); Code_JEDEC: TO-226-AA
R?#44-R?#54 = Res2: Resistor; Published: 8-Jun-2000; LatestRevisionDate: 17-Jul-2002; LatestRevisionNote: Re-released for DXP Platform.; PackageReference: AXIAL-0.4; Publisher: Altium Limited; PackageDescription: Axial Device, Thru-Hole; 2 Leads; 0.4 in Pin Spacing
U?#26 = AD5422ACPZ-REEL7: as U?#17 on sheet vioutchn1; DatasheetVersion: Rev.E; PackageVersion: Oct-2006; PackageReference: CP-40-1; PackageDescription: 40-Pin Lead Frame Chip Scale Package [LFCSP_VQ] Very Thin Quad; Supplier 1: Digi-Key; Supplier Part Number 1: AD5422ACPZ-REEL7TR-ND; Supplier 2: Digi-Key; Supplier Part Number 2: AD5422ACPZ-REEL7CT-ND; Supplier 3: Digi-Key; Supplier Part Number 3: AD5422ACPZ-REEL7DKR-ND; Supplier 4: Mouser; Supplier Part Number 4: 584-AD5422ACPZ-R7; Packing: Reel; RoHS: Y; Mounting Technology: Surface Mount; Code_JEDEC: MO-220-VJJD-2; PartNumber: AD5422ACPZ-REEL7; ComponentLink1Description: Manufacturer URL; ComponentLink1URL: http://www.analog.com/en/index.html; ComponentLink2Description: Datasheet; ComponentLink2URL: http://www.analog.com/static/imported-files/data_sheets/AD5412_5422.pdf; ComponentLink3Description: Package Specification; ComponentLink3URL: http://www.analog.com/static/imported-files/packages/PKG_PDF/LFCSP(CP)/CP_40_1.pdf; ComponentLink4Description: Product URL; ComponentLink4URL: http://www.analog.com/en/digital-to-analog-converters/da-converters/ad5422/products/product.html; ComponentLink5Description: Reference Design URL; ComponentLink5URL: http://www.analog.com/en/digital-to-analog-converters/da-converters/ad5422/products/product.html#prod_cross_sell

## Sheet vioutchn5.SchDoc: VIOUTCHN1
size A4 portrait; Organization: 合肥弗雷电子; Address1: 玉兰大道14号D栋3楼; Address2: 肥西县桃花镇; Address3: 合肥市; Address4: 安徽省
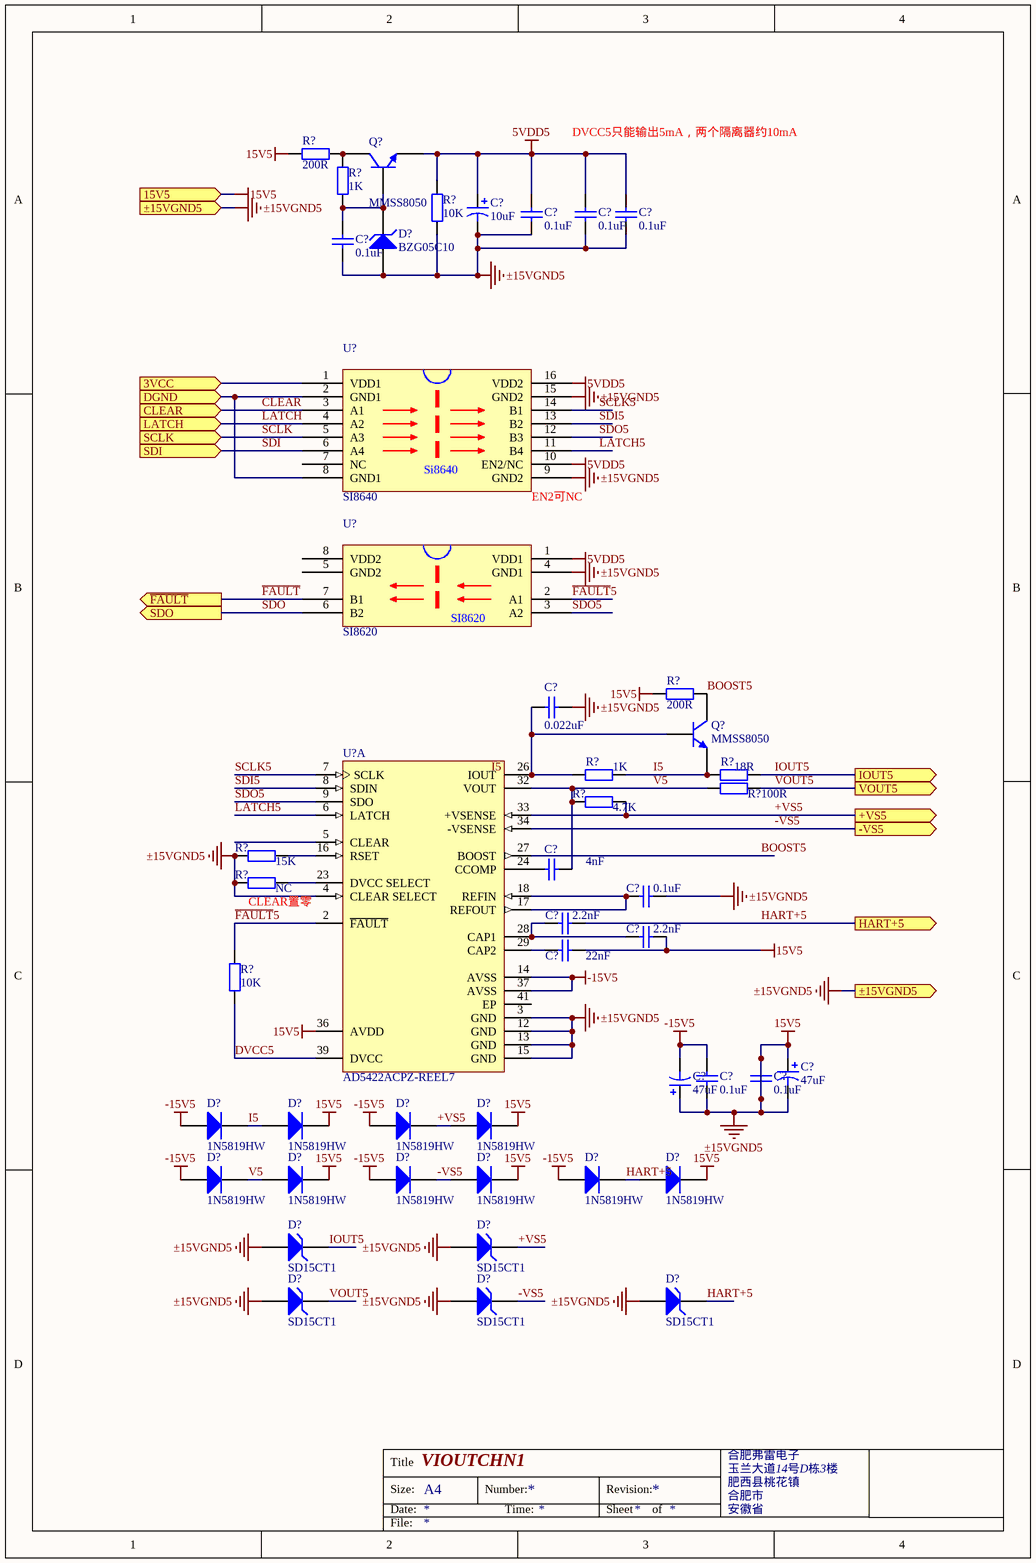
[diagram p11: vioutchn5.SchDoc]

### Parts
(Parts that share a designator on the sheet are numbered #1, #2 ... from top to bottom, then left to right.)
C?#101  value 10uF  [CB]  (hidden comment: T494B106M006AHAUTO)
C?#102  value 0.1uF  [0805c]  (hidden comment: CC0805MRX7R9BB104)
C?#103  value 0.1uF  [0805c]  (hidden comment: CC0805MRX7R9BB104)
C?#104  value 0.1uF  [0805c]  (hidden comment: CC0805MRX7R9BB104)
C?#105  value 0.1uF  [0805c]  (hidden comment: CC0805MRX7R9BB104)
C?#106  value 0.022uF  [0805c]  (hidden comment: CC0805MRX7R9BB103)
C?#107  value 4nF  [0805c]
C?#108  value 0.1uF  [0805c]  (hidden comment: CC0805MRX7R9BB104)
C?#109  value 2.2nF  [0805c]
C?#110  value 2.2nF  [0805c]
C?#111  value 22nF  [0805c]
C?#112  value 0.1uF  [0805c]  (hidden comment: CC0805MRX7R9BB104)
C?#113  value 0.1uF  [0805c]  (hidden comment: CC0805MRX7R9BB104)
C?#114  value 47uF  [CB]  (hidden comment: T494B476K025ATAUTO)
C?#115  value 47uF  [CB]  (hidden comment: T494B476K025ATAUTO)
D?#81  BZG05C10  [DO214]
D?#82  1N5819HW  [sod123]
D?#83  1N5819HW  [sod123]
D?#84  1N5819HW  [sod123]
D?#85  1N5819HW  [sod123]
D?#86  1N5819HW  [sod123]
D?#87  1N5819HW  [sod123]
D?#88  1N5819HW  [sod123]
D?#89  1N5819HW  [sod123]
D?#90  1N5819HW  [sod123]
D?#91  1N5819HW  [sod123]
D?#92  SD15CT1  [sod323]
D?#93  SD15CT1  [sod323]
D?#94  SD15CT1  [sod323]
D?#95  SD15CT1  [sod323]
D?#96  SD15CT1  [sod323]
Q?#11  MMSS8050  [SOT-23-BJT]
Q?#12  MMSS8050  [SOT-23-BJT]
R?#55  value 200R  [0805R]
R?#56  value 1K  [0805R]  (hidden comment: RC0805JR-071KL)
R?#57  value 10K  [0805R]  (hidden comment: RC0805JR-0710KL)
R?#58  value 200R  [0805R]
R?#59  value 1K  [0805R]  (hidden comment: RC0805JR-071KL)
R?#60  value 18R  [0805R]
R?#61  value 100R  [0805R]
R?#62  value 4.7K  [0805R]
R?#63  value 15K  [0805R]  (hidden comment: E192)
R?#64  value NC  [0805R]  (hidden comment: E192)
R?#65  value 10K  [0805R]  (hidden comment: RC0805JR-0710KL)
U?#27  SI8640
U?#28  SI8620
U?#29  AD5422ACPZ-REEL7  [CP-40-1_N]  (part A of 2)

### Ports
3VCC (in), 15V5 (in), +VS5 (out), -VS5 (out), CLEAR (in), DGND (in), HART+5 (out), IOUT5 (out), LATCH (in), SCLK (in), SDI (in), SDO (out), VOUT5 (out), ~{FAULT} (out), ±15VGND5 (in), ±15VGND5 (out)

### Nets
5VDD5: C?#101.1 C?#102.2 C?#103.2 C?#104.2 Q?#11.3(E) R?#57.1 U?#27.10(EN2/NC) U?#27.16(VDD2) U?#28.1(VDD1)
15V5: C?#101.2 C?#102.1 C?#103.1 C?#104.1 C?#105.2 C?#106.1 C?#108.2 C?#110.1 C?#111.1 C?#112.2 C?#113.1 C?#113.2 C?#114.1 C?#114.2 C?#115.1 D?#81.1(A) D?#83.2(K) D?#85.2(K) D?#87.2(K) D?#89.2(K) D?#91.2(K) D?#92.1(A) D?#93.1(A) D?#94.1(A) D?#95.1(A) D?#96.1(A) R?#55.2 R?#57.2 R?#58.2 R?#63.1 R?#64.1 U?#27.9(GND2) U?#27.15(GND2) U?#28.4(GND1) U?#29.3(GND) U?#29.4(CLEAR_SELECT) U?#29.12(GND) U?#29.13(GND) U?#29.15(GND) U?#29.36(AVDD) ; port 15V5, port ±15VGND5  [also labelled ±15VGND5]
-15V5: C?#112.1 C?#115.2 D?#82.1(A) D?#84.1(A) D?#86.1(A) D?#88.1(A) D?#90.1(A) U?#29.14(AVSS) U?#29.37(AVSS)
+VS5: D?#84.2(K) D?#85.1(A) D?#93.2(K) R?#62.2 U?#29.33(+VSENSE) ; port +VS5
-VS5: D?#88.2(K) D?#89.1(A) D?#95.2(K) U?#29.34(-VSENSE) ; port -VS5
BOOST5: Q?#12.1(C) R?#58.1 U?#29.27(BOOST)
CLEAR: U?#27.3(A1) ; port CLEAR
DVCC5: R?#65.2 U?#29.39(DVCC)
~{FAULT}: U?#28.7(B1) ; port ~{FAULT}
~{FAULT}5: R?#65.1 U?#28.2(A1) U?#29.2(~{FAULT})
HART+5: C?#109.1 D?#90.2(K) D?#91.1(A) D?#96.2(K) ; port HART+5
I5: D?#82.2(K) D?#83.1(A) Q?#12.3(E) R?#59.2 R?#60.1
IOUT5: D?#92.2(K) R?#60.2 ; port IOUT5
LATCH: U?#27.4(A2) ; port LATCH
LATCH5: U?#27.11(B4) U?#29.6(LATCH)
SCLK: U?#27.5(A3) ; port SCLK
SCLK5: U?#27.14(B1) U?#29.7(SCLK)
SDI: U?#27.6(A4) ; port SDI
SDI5: U?#27.13(B2) U?#29.8(SDIN)
SDO: U?#28.6(B2) ; port SDO
SDO5: U?#27.12(B3) U?#28.3(A2) U?#29.9(SDO)
V5: C?#107.2 D?#86.2(K) D?#87.1(A) R?#61.1 R?#62.1 U?#29.32(VOUT)
VOUT5: D?#94.2(K) R?#61.2 ; port VOUT5
NetC?#105_1: C?#105.1 D?#81.2(K) Q?#11.2(B) R?#56.1
NetC?#106_2: C?#106.2 Q?#12.2(B) R?#59.1 U?#29.26(IOUT)
NetC?#107_1: C?#107.1 U?#29.24(CCOMP)
NetC?#108_1: C?#108.1 U?#29.17(REFOUT) U?#29.18(REFIN)
NetC?#109_2: C?#109.2 C?#110.2 U?#29.28(CAP1)
NetC?#111_2: C?#111.2 U?#29.29(CAP2)
NetQ?#11_1: Q?#11.1(C) R?#55.1 R?#56.2
NetR?#63_2: R?#63.2 U?#29.16(RSET)
NetR?#64_2: R?#64.2 U?#29.23(DVCC_SELECT)
NetU?#27_1: U?#27.1(VDD1) ; port 3VCC
NetU?#27_2: U?#27.2(GND1) U?#27.8(GND1) ; port DGND

Not connected (* = marked no-connect by the designer): U?#27 7(NC); U?#28 5(GND2) 8(VDD2); U?#29 5(CLEAR) 41(EP)

### Notes on the sheet
- DVCC5只能输出5mA，两个隔离器约10mA
- (near U?#27) EN2可NC
- (near R?#64) CLEAR置零
- Labels drawn without touching a wire or pin: I5
- Title
- Size:
- Date:
- A4
- Number:
- Time:
- Revision:
- Sheet
- of
- File:
- (in symbol SI8640) Si8640

### Library data of the parts
C?#101 C?#114 C?#115 = Cap Pol1: Polarized Capacitor (Radial); Published: 8-Jun-2000; LatestRevisionDate: 17-Jul-2002; LatestRevisionNote: Re-released for DXP Platform.; PackageReference: RB7.6-15; Publisher: Altium Limited; PackageDescription: Polarized Capacitor (Radial); 2 Leads
C?#102-C?#113 = Cap: Capacitor; Published: 8-Jun-2000; LatestRevisionDate: 17-Jul-2002; LatestRevisionNote: Re-released for DXP Platform.; PackageReference: RAD-0.3; Publisher: Altium Limited; PackageDescription: Radial Cap, Thru-Hole; 2 Leads; 0.3 in Pin Spacing
D?#81 = BZG05C10: Silicon Zener Diode (3W); Published: 8-Jun-2000; LatestRevisionDate: 17-Jul-2002; LatestRevisionNote: Re-released for DXP Platform.; DatasheetDocument: 1-Apr-1999; PackageDocument: Apr-1999; PackageReference: DO214; Publisher: Altium Limited; ComponentLink1Description: Manufacturer Link; ComponentLink1URL: http://www.vishay.com/; ComponentLink2Description: Datasheet; ComponentLink2URL: http://www.vishay.com/docs/85595/85595.pdf
D?#82-D?#91 = Diode: Default Diode; Published: 8-Jun-2000; LatestRevisionDate: 17-Jul-2002; LatestRevisionNote: Re-released for DXP Platform.; PackageVersion: Sep-1996; PackageReference: SMC; Publisher: Altium Limited; PackageDescription: DO-214-AB/SMC; 2 C-Bend Leads; Body 7.9 x 5.9 mm, inc. leads (LxW); Code_JEDEC: DO-214-AB
D?#92-D?#96 = D Zener: Zener Diode; Published: 8-Jun-2000; LatestRevisionDate: 17-Jul-2002; LatestRevisionNote: Re-released for DXP Platform.; PackageReference: DIODE-0.7; Publisher: Altium Limited; PackageDescription: Diode, Thru-Hole; 2 Leads; 0.7 in Pin Spacing
Q?#11 Q?#12 = NPN: NPN Bipolar Transistor; Published: 8-Jun-2000; LatestRevisionDate: 17-Jul-2002; LatestRevisionNote: Re-released for DXP Platform.; PackageReference: TO-226-AA; Publisher: Altium Limited; PackageDescription: TO, Flat Index; 3 In-Line, Axial Leads; Body Dia. 4.8mm; Leads 0.55 x 0.51 mm (max); Code_JEDEC: TO-226-AA
R?#55-R?#65 = Res2: Resistor; Published: 8-Jun-2000; LatestRevisionDate: 17-Jul-2002; LatestRevisionNote: Re-released for DXP Platform.; PackageReference: AXIAL-0.4; Publisher: Altium Limited; PackageDescription: Axial Device, Thru-Hole; 2 Leads; 0.4 in Pin Spacing
U?#29 = AD5422ACPZ-REEL7: as U?#17 on sheet vioutchn1; DatasheetVersion: Rev.E; PackageVersion: Oct-2006; PackageReference: CP-40-1; PackageDescription: 40-Pin Lead Frame Chip Scale Package [LFCSP_VQ] Very Thin Quad; Supplier 1: Digi-Key; Supplier Part Number 1: AD5422ACPZ-REEL7TR-ND; Supplier 2: Digi-Key; Supplier Part Number 2: AD5422ACPZ-REEL7CT-ND; Supplier 3: Digi-Key; Supplier Part Number 3: AD5422ACPZ-REEL7DKR-ND; Supplier 4: Mouser; Supplier Part Number 4: 584-AD5422ACPZ-R7; Packing: Reel; RoHS: Y; Mounting Technology: Surface Mount; Code_JEDEC: MO-220-VJJD-2; PartNumber: AD5422ACPZ-REEL7; ComponentLink1Description: Manufacturer URL; ComponentLink1URL: http://www.analog.com/en/index.html; ComponentLink2Description: Datasheet; ComponentLink2URL: http://www.analog.com/static/imported-files/data_sheets/AD5412_5422.pdf; ComponentLink3Description: Package Specification; ComponentLink3URL: http://www.analog.com/static/imported-files/packages/PKG_PDF/LFCSP(CP)/CP_40_1.pdf; ComponentLink4Description: Product URL; ComponentLink4URL: http://www.analog.com/en/digital-to-analog-converters/da-converters/ad5422/products/product.html; ComponentLink5Description: Reference Design URL; ComponentLink5URL: http://www.analog.com/en/digital-to-analog-converters/da-converters/ad5422/products/product.html#prod_cross_sell

## Sheet vioutchn6.SchDoc: VIOUTCHN1
size A4 portrait; Organization: 合肥弗雷电子; Address1: 玉兰大道14号D栋3楼; Address2: 肥西县桃花镇; Address3: 合肥市; Address4: 安徽省
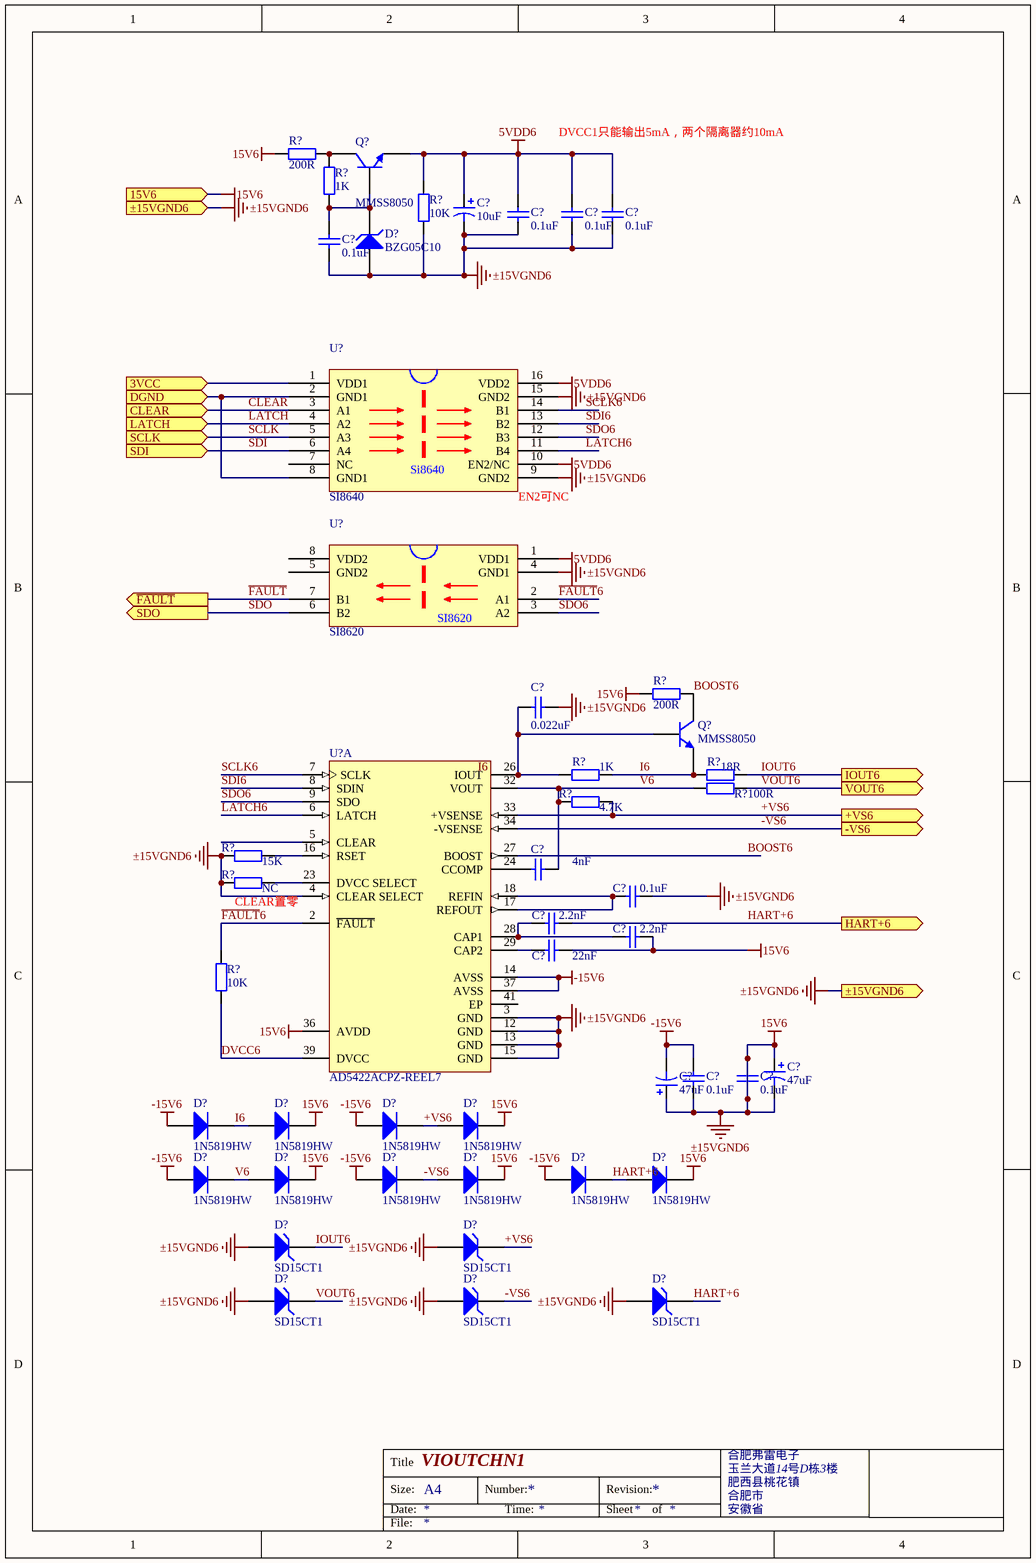
[diagram p12: vioutchn6.SchDoc]

### Parts
(Parts that share a designator on the sheet are numbered #1, #2 ... from top to bottom, then left to right.)
C?#116  value 10uF  [CB]  (hidden comment: T494B106M006AHAUTO)
C?#117  value 0.1uF  [0805c]  (hidden comment: CC0805MRX7R9BB104)
C?#118  value 0.1uF  [0805c]  (hidden comment: CC0805MRX7R9BB104)
C?#119  value 0.1uF  [0805c]  (hidden comment: CC0805MRX7R9BB104)
C?#120  value 0.1uF  [0805c]  (hidden comment: CC0805MRX7R9BB104)
C?#121  value 0.022uF  [0805c]  (hidden comment: CC0805MRX7R9BB103)
C?#122  value 4nF  [0805c]
C?#123  value 0.1uF  [0805c]  (hidden comment: CC0805MRX7R9BB104)
C?#124  value 2.2nF  [0805c]
C?#125  value 2.2nF  [0805c]
C?#126  value 22nF  [0805c]
C?#127  value 0.1uF  [0805c]  (hidden comment: CC0805MRX7R9BB104)
C?#128  value 0.1uF  [0805c]  (hidden comment: CC0805MRX7R9BB104)
C?#129  value 47uF  [CB]  (hidden comment: T494B476K025ATAUTO)
C?#130  value 47uF  [CB]  (hidden comment: T494B476K025ATAUTO)
D?#97  BZG05C10  [DO214]
D?#98  1N5819HW  [sod123]
D?#99  1N5819HW  [sod123]
D?#100  1N5819HW  [sod123]
D?#101  1N5819HW  [sod123]
D?#102  1N5819HW  [sod123]
D?#103  1N5819HW  [sod123]
D?#104  1N5819HW  [sod123]
D?#105  1N5819HW  [sod123]
D?#106  1N5819HW  [sod123]
D?#107  1N5819HW  [sod123]
D?#108  SD15CT1  [sod323]
D?#109  SD15CT1  [sod323]
D?#110  SD15CT1  [sod323]
D?#111  SD15CT1  [sod323]
D?#112  SD15CT1  [sod323]
Q?#13  MMSS8050  [SOT-23-BJT]
Q?#14  MMSS8050  [SOT-23-BJT]
R?#66  value 200R  [0805R]
R?#67  value 1K  [0805R]  (hidden comment: RC0805JR-071KL)
R?#68  value 10K  [0805R]  (hidden comment: RC0805JR-0710KL)
R?#69  value 200R  [0805R]
R?#70  value 1K  [0805R]  (hidden comment: RC0805JR-071KL)
R?#71  value 18R  [0805R]
R?#72  value 100R  [0805R]
R?#73  value 4.7K  [0805R]
R?#74  value 15K  [0805R]  (hidden comment: E192)
R?#75  value NC  [0805R]  (hidden comment: E192)
R?#76  value 10K  [0805R]  (hidden comment: RC0805JR-0710KL)
U?#30  SI8640
U?#31  SI8620
U?#32  AD5422ACPZ-REEL7  [CP-40-1_N]  (part A of 2)

### Ports
3VCC (in), 15V6 (in), +VS6 (out), -VS6 (out), CLEAR (in), DGND (in), HART+6 (out), IOUT6 (out), LATCH (in), SCLK (in), SDI (in), SDO (out), VOUT6 (out), ~{FAULT} (out), ±15VGND6 (in), ±15VGND6 (out)

### Nets
5VDD6: C?#116.1 C?#117.2 C?#118.2 C?#119.2 Q?#13.3(E) R?#68.1 U?#30.10(EN2/NC) U?#30.16(VDD2) U?#31.1(VDD1)
15V6: C?#116.2 C?#117.1 C?#118.1 C?#119.1 C?#120.2 C?#121.1 C?#123.2 C?#125.1 C?#126.1 C?#127.2 C?#128.1 C?#128.2 C?#129.1 C?#129.2 C?#130.1 D?#97.1(A) D?#99.2(K) D?#101.2(K) D?#103.2(K) D?#105.2(K) D?#107.2(K) D?#108.1(A) D?#109.1(A) D?#110.1(A) D?#111.1(A) D?#112.1(A) R?#66.2 R?#68.2 R?#69.2 R?#74.1 R?#75.1 U?#30.9(GND2) U?#30.15(GND2) U?#31.4(GND1) U?#32.3(GND) U?#32.4(CLEAR_SELECT) U?#32.12(GND) U?#32.13(GND) U?#32.15(GND) U?#32.36(AVDD) ; port 15V6, port ±15VGND6  [also labelled ±15VGND6]
-15V6: C?#127.1 C?#130.2 D?#98.1(A) D?#100.1(A) D?#102.1(A) D?#104.1(A) D?#106.1(A) U?#32.14(AVSS) U?#32.37(AVSS)
+VS6: D?#100.2(K) D?#101.1(A) D?#109.2(K) R?#73.2 U?#32.33(+VSENSE) ; port +VS6
-VS6: D?#104.2(K) D?#105.1(A) D?#111.2(K) U?#32.34(-VSENSE) ; port -VS6
BOOST6: Q?#14.1(C) R?#69.1 U?#32.27(BOOST)
CLEAR: U?#30.3(A1) ; port CLEAR
DVCC6: R?#76.2 U?#32.39(DVCC)
~{FAULT}: U?#31.7(B1) ; port ~{FAULT}
~{FAULT}6: R?#76.1 U?#31.2(A1) U?#32.2(~{FAULT})
HART+6: C?#124.1 D?#106.2(K) D?#107.1(A) D?#112.2(K) ; port HART+6
I6: D?#98.2(K) D?#99.1(A) Q?#14.3(E) R?#70.2 R?#71.1
IOUT6: D?#108.2(K) R?#71.2 ; port IOUT6
LATCH: U?#30.4(A2) ; port LATCH
LATCH6: U?#30.11(B4) U?#32.6(LATCH)
SCLK: U?#30.5(A3) ; port SCLK
SCLK6: U?#30.14(B1) U?#32.7(SCLK)
SDI: U?#30.6(A4) ; port SDI
SDI6: U?#30.13(B2) U?#32.8(SDIN)
SDO: U?#31.6(B2) ; port SDO
SDO6: U?#30.12(B3) U?#31.3(A2) U?#32.9(SDO)
V6: C?#122.2 D?#102.2(K) D?#103.1(A) R?#72.1 R?#73.1 U?#32.32(VOUT)
VOUT6: D?#110.2(K) R?#72.2 ; port VOUT6
NetC?#120_1: C?#120.1 D?#97.2(K) Q?#13.2(B) R?#67.1
NetC?#121_2: C?#121.2 Q?#14.2(B) R?#70.1 U?#32.26(IOUT)
NetC?#122_1: C?#122.1 U?#32.24(CCOMP)
NetC?#123_1: C?#123.1 U?#32.17(REFOUT) U?#32.18(REFIN)
NetC?#124_2: C?#124.2 C?#125.2 U?#32.28(CAP1)
NetC?#126_2: C?#126.2 U?#32.29(CAP2)
NetQ?#13_1: Q?#13.1(C) R?#66.1 R?#67.2
NetR?#74_2: R?#74.2 U?#32.16(RSET)
NetR?#75_2: R?#75.2 U?#32.23(DVCC_SELECT)
NetU?#30_1: U?#30.1(VDD1) ; port 3VCC
NetU?#30_2: U?#30.2(GND1) U?#30.8(GND1) ; port DGND

Not connected (* = marked no-connect by the designer): U?#30 7(NC); U?#31 5(GND2) 8(VDD2); U?#32 5(CLEAR) 41(EP)

### Notes on the sheet
- DVCC1只能输出5mA，两个隔离器约10mA
- (near U?#30) EN2可NC
- (near R?#75) CLEAR置零
- Labels drawn without touching a wire or pin: I6
- Title
- Size:
- Date:
- A4
- Number:
- Time:
- Revision:
- Sheet
- of
- File:
- (in symbol SI8640) Si8640

### Library data of the parts
C?#116 C?#129 C?#130 = Cap Pol1: Polarized Capacitor (Radial); Published: 8-Jun-2000; LatestRevisionDate: 17-Jul-2002; LatestRevisionNote: Re-released for DXP Platform.; PackageReference: RB7.6-15; Publisher: Altium Limited; PackageDescription: Polarized Capacitor (Radial); 2 Leads
C?#117-C?#128 = Cap: Capacitor; Published: 8-Jun-2000; LatestRevisionDate: 17-Jul-2002; LatestRevisionNote: Re-released for DXP Platform.; PackageReference: RAD-0.3; Publisher: Altium Limited; PackageDescription: Radial Cap, Thru-Hole; 2 Leads; 0.3 in Pin Spacing
D?#97 = BZG05C10: Silicon Zener Diode (3W); Published: 8-Jun-2000; LatestRevisionDate: 17-Jul-2002; LatestRevisionNote: Re-released for DXP Platform.; DatasheetDocument: 1-Apr-1999; PackageDocument: Apr-1999; PackageReference: DO214; Publisher: Altium Limited; ComponentLink1Description: Manufacturer Link; ComponentLink1URL: http://www.vishay.com/; ComponentLink2Description: Datasheet; ComponentLink2URL: http://www.vishay.com/docs/85595/85595.pdf
D?#98-D?#107 = Diode: Default Diode; Published: 8-Jun-2000; LatestRevisionDate: 17-Jul-2002; LatestRevisionNote: Re-released for DXP Platform.; PackageVersion: Sep-1996; PackageReference: SMC; Publisher: Altium Limited; PackageDescription: DO-214-AB/SMC; 2 C-Bend Leads; Body 7.9 x 5.9 mm, inc. leads (LxW); Code_JEDEC: DO-214-AB
D?#108-D?#112 = D Zener: Zener Diode; Published: 8-Jun-2000; LatestRevisionDate: 17-Jul-2002; LatestRevisionNote: Re-released for DXP Platform.; PackageReference: DIODE-0.7; Publisher: Altium Limited; PackageDescription: Diode, Thru-Hole; 2 Leads; 0.7 in Pin Spacing
Q?#13 Q?#14 = NPN: NPN Bipolar Transistor; Published: 8-Jun-2000; LatestRevisionDate: 17-Jul-2002; LatestRevisionNote: Re-released for DXP Platform.; PackageReference: TO-226-AA; Publisher: Altium Limited; PackageDescription: TO, Flat Index; 3 In-Line, Axial Leads; Body Dia. 4.8mm; Leads 0.55 x 0.51 mm (max); Code_JEDEC: TO-226-AA
R?#66-R?#76 = Res2: Resistor; Published: 8-Jun-2000; LatestRevisionDate: 17-Jul-2002; LatestRevisionNote: Re-released for DXP Platform.; PackageReference: AXIAL-0.4; Publisher: Altium Limited; PackageDescription: Axial Device, Thru-Hole; 2 Leads; 0.4 in Pin Spacing
U?#32 = AD5422ACPZ-REEL7: as U?#17 on sheet vioutchn1; DatasheetVersion: Rev.E; PackageVersion: Oct-2006; PackageReference: CP-40-1; PackageDescription: 40-Pin Lead Frame Chip Scale Package [LFCSP_VQ] Very Thin Quad; Supplier 1: Digi-Key; Supplier Part Number 1: AD5422ACPZ-REEL7TR-ND; Supplier 2: Digi-Key; Supplier Part Number 2: AD5422ACPZ-REEL7CT-ND; Supplier 3: Digi-Key; Supplier Part Number 3: AD5422ACPZ-REEL7DKR-ND; Supplier 4: Mouser; Supplier Part Number 4: 584-AD5422ACPZ-R7; Packing: Reel; RoHS: Y; Mounting Technology: Surface Mount; Code_JEDEC: MO-220-VJJD-2; PartNumber: AD5422ACPZ-REEL7; ComponentLink1Description: Manufacturer URL; ComponentLink1URL: http://www.analog.com/en/index.html; ComponentLink2Description: Datasheet; ComponentLink2URL: http://www.analog.com/static/imported-files/data_sheets/AD5412_5422.pdf; ComponentLink3Description: Package Specification; ComponentLink3URL: http://www.analog.com/static/imported-files/packages/PKG_PDF/LFCSP(CP)/CP_40_1.pdf; ComponentLink4Description: Product URL; ComponentLink4URL: http://www.analog.com/en/digital-to-analog-converters/da-converters/ad5422/products/product.html; ComponentLink5Description: Reference Design URL; ComponentLink5URL: http://www.analog.com/en/digital-to-analog-converters/da-converters/ad5422/products/product.html#prod_cross_sell